# EAGLE design COM_ETH-V1 (EAGLE 4.16)

## Sheet 1 of 3
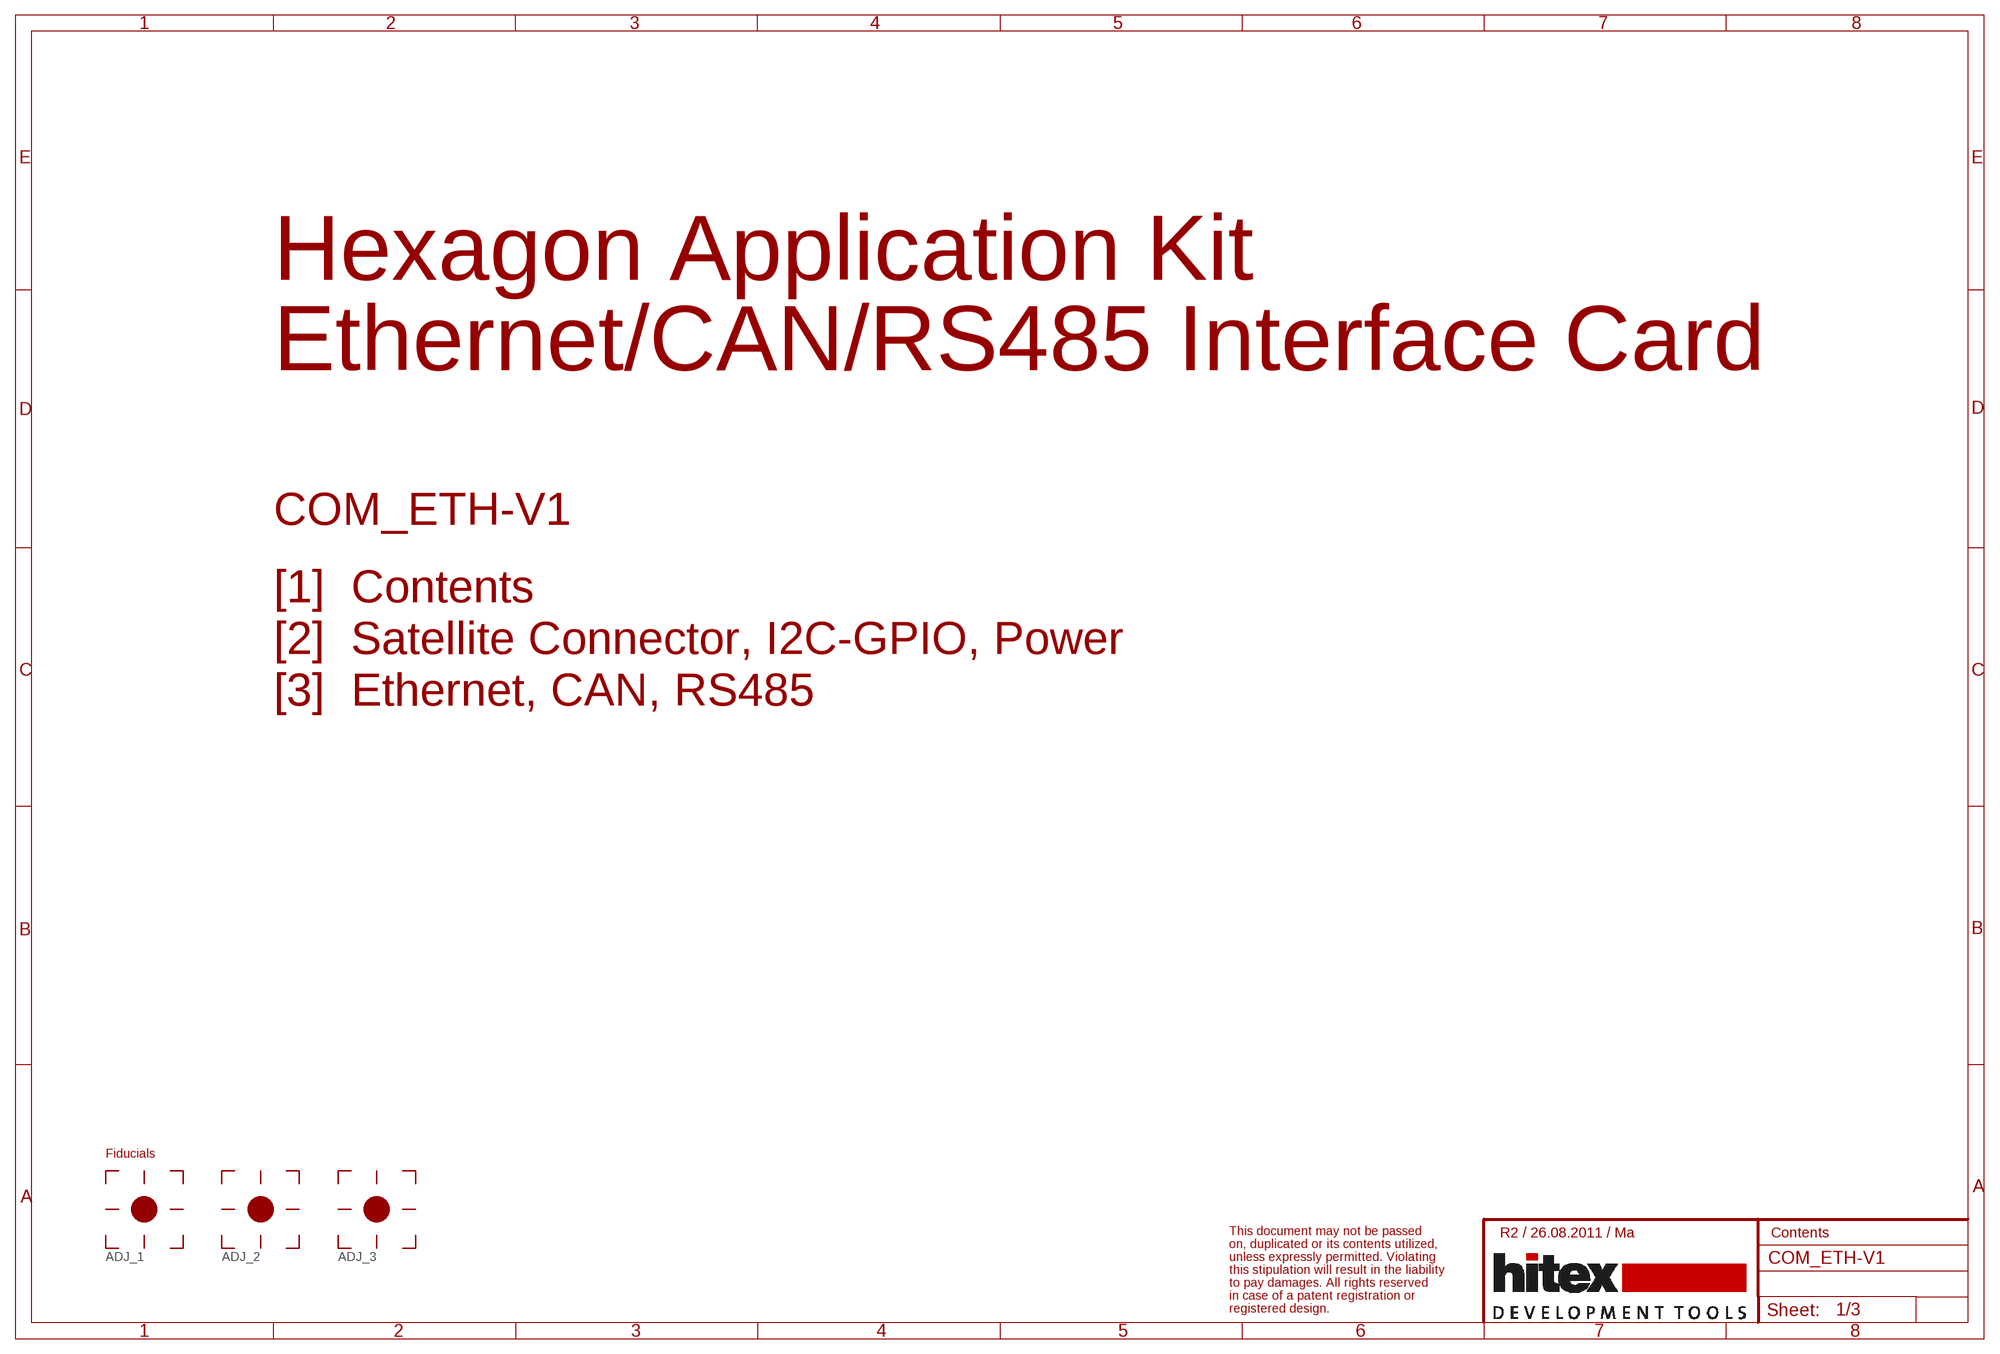
[diagram p0: schematic, sheet 1]

### Parts
ADJ_1  FIDUCIAL  [FIDUCIAL]
ADJ_2  FIDUCIAL  [FIDUCIAL]
ADJ_3  FIDUCIAL  [FIDUCIAL]

### Notes on the sheet
- Hexagon Application Kit
- Ethernet/CAN/RS485 Interface Card
- COM_ETH-V1
- [1]  Contents
- [2]  Satellite Connector, I2C-GPIO, Power
- [3]  Ethernet, CAN, RS485
- Fiducials
- R2 / 26.08.2011 / Ma | Contents

## Sheet 2 of 3
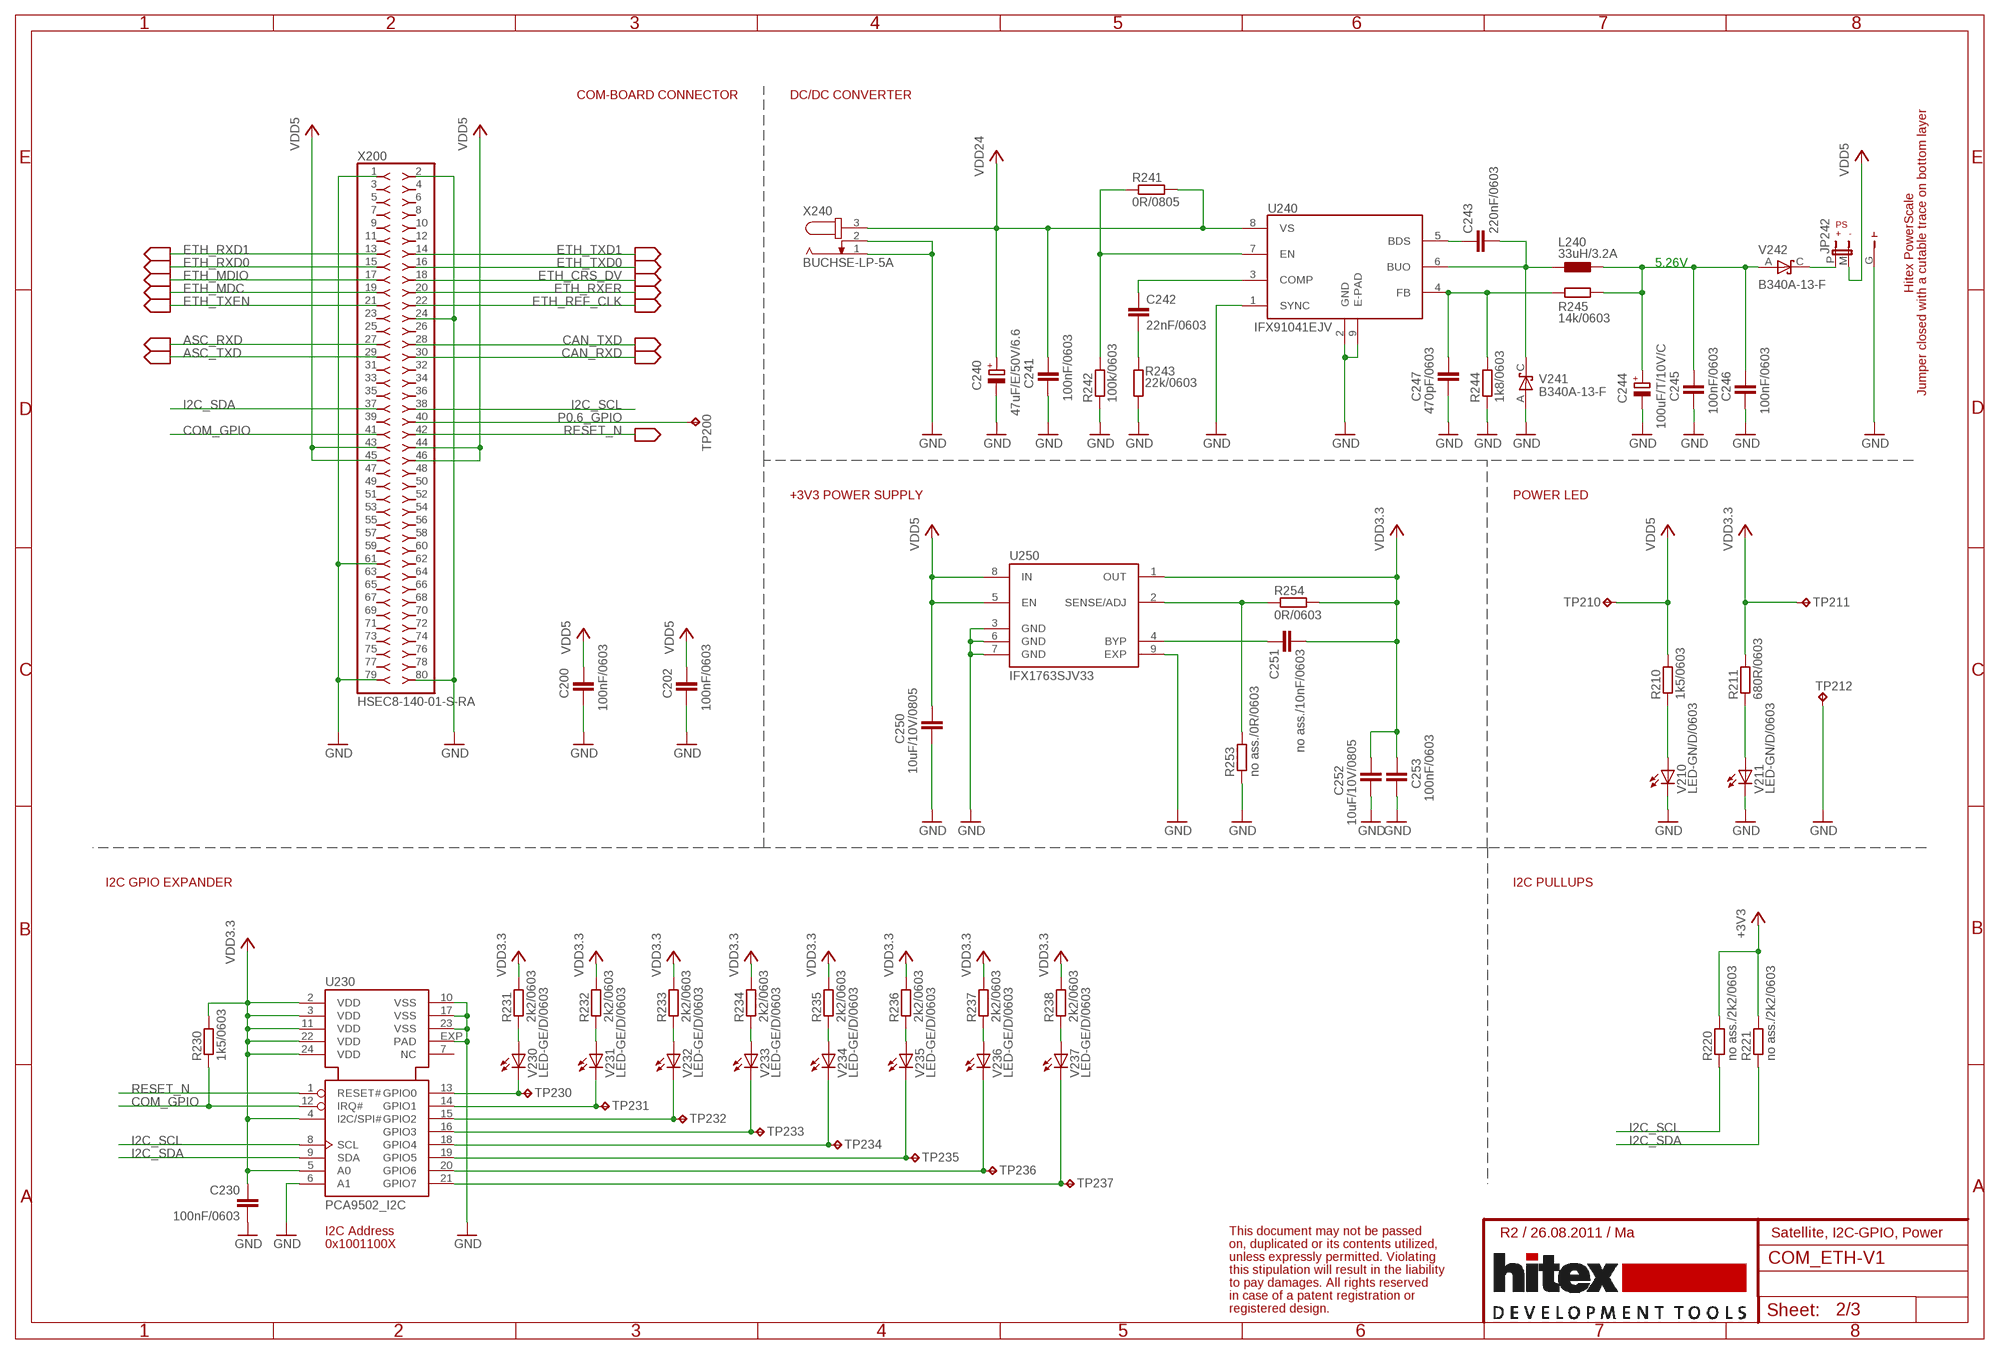
[diagram p1: schematic, sheet 2]

### Parts
C200  100nF/0603  C-EUC0603  [C0603]
C202  100nF/0603  C-EUC0603  [C0603]
C230  100nF/0603  C-EUC0603  [C0603]
C240  47uF/E/50V/6.6  CPOL-EUD  [PANASONIC_D]
C241  100nF/0603  C-EUC0603  [C0603]
C242  22nF/0603  C-EUC0603  [C0603]
C243  220nF/0603  C-EUC0603  [C0603]
C244  100uF/T/10V/C  CPOL-EUSMCC  [SMC_C]
C245  100nF/0603  C-EUC0603  [C0603]
C246  100nF/0603  C-EUC0603  [C0603]
C247  470pF/0603  C-EUC0603  [C0603]
C250  10uF/10V/0805  C-EUC0805K  [C0805K]
C251  no ass./10nF/0603  C-EUC0603  [C0603]
C252  10uF/10V/0805  C-EUC0805K  [C0805K]
C253  100nF/0603  C-EUC0603  [C0603]
JP242  POWERSCALE3  [PS3_PMG]
L240  33uH/3.2A  IHLP-3232DZ-11  [IHLP-3232DZ-11]
R210  1k5/0603  R-EU_R0603  [R0603]
R211  680R/0603  R-EU_R0603  [R0603]
R220  no ass./2k2/0603  R-EU_R0603  [R0603]
R221  no ass./2k2/0603  R-EU_R0603  [R0603]
R230  1k5/0603  R-EU_R0603  [R0603]
R231  2k2/0603  R-EU_R0603  [R0603]
R232  2k2/0603  R-EU_R0603  [R0603]
R233  2k2/0603  R-EU_R0603  [R0603]
R234  2k2/0603  R-EU_R0603  [R0603]
R235  2k2/0603  R-EU_R0603  [R0603]
R236  2k2/0603  R-EU_R0603  [R0603]
R237  2k2/0603  R-EU_R0603  [R0603]
R238  2k2/0603  R-EU_R0603  [R0603]
R241  0R/0805  R-EU_R0805  [R0805]
R242  100k/0603  R-EU_R0603  [R0603]
R243  22k/0603  R-EU_R0603  [R0603]
R244  1k8/0603  R-EU_R0603  [R0603]
R245  14k/0603  R-EU_R0603  [R0603]
R253  no ass./0R/0603  R-EU_R0603  [R0603]
R254  0R/0603  R-EU_R0603  [R0603]
TP200  TPAD1.5MM_RUND  [TPAD_1.5MM_RUND]
TP210  TPAD1.5MM_RUND  [TPAD_1.5MM_RUND]
TP211  TPAD1.5MM_RUND  [TPAD_1.5MM_RUND]
TP212  TPAD1.5MM_RUND  [TPAD_1.5MM_RUND]
TP230  TPAD1.5MM_RUND  [TPAD_1.5MM_RUND]
TP231  TPAD1.5MM_RUND  [TPAD_1.5MM_RUND]
TP232  TPAD1.5MM_RUND  [TPAD_1.5MM_RUND]
TP233  TPAD1.5MM_RUND  [TPAD_1.5MM_RUND]
TP234  TPAD1.5MM_RUND  [TPAD_1.5MM_RUND]
TP235  TPAD1.5MM_RUND  [TPAD_1.5MM_RUND]
TP236  TPAD1.5MM_RUND  [TPAD_1.5MM_RUND]
TP237  TPAD1.5MM_RUND  [TPAD_1.5MM_RUND]
U230  PCA9502_I2C  [HVQFN24]
U240  IFX91041EJV  [PSOP-8]
U250  IFX1763SJV33  IFX1763_PADNOP  [PG-DSO-8-27_NO-PASTE]
V210  LED-GN/D/0603  LEDCHIPLED_0603  [CHIPLED_0603]
V211  LED-GN/D/0603  LEDCHIPLED_0603  [CHIPLED_0603]
V230  LED-GE/D/0603  LEDCHIPLED_0603  [CHIPLED_0603]
V231  LED-GE/D/0603  LEDCHIPLED_0603  [CHIPLED_0603]
V232  LED-GE/D/0603  LEDCHIPLED_0603  [CHIPLED_0603]
V233  LED-GE/D/0603  LEDCHIPLED_0603  [CHIPLED_0603]
V234  LED-GE/D/0603  LEDCHIPLED_0603  [CHIPLED_0603]
V235  LED-GE/D/0603  LEDCHIPLED_0603  [CHIPLED_0603]
V236  LED-GE/D/0603  LEDCHIPLED_0603  [CHIPLED_0603]
V237  LED-GE/D/0603  LEDCHIPLED_0603  [CHIPLED_0603]
V241  B340A-13-F  [DO214AC]
V242  B340A-13-F  [DO214AC]
X200  HSEC8-140-01-S-RA  [HSEC8-140-XX-X-RA]
X240  BUCHSE-LP-5A  JACK-PLUG0  [SPC4077]

### Nets
ASC_RXD: X200.27 ; also sheet 3
ASC_TXD: X200.29 ; also sheet 3
CAN_RXD: X200.30 ; also sheet 3
CAN_TXD: X200.28 ; also sheet 3
COM_GPIO: R230.1 U230.12(IRQ#) X200.41
ETH_CRS_DV: X200.18 ; also sheet 3
ETH_MDC: X200.19 ; also sheet 3
ETH_MDIO: X200.17 ; also sheet 3
ETH_REF_CLK: X200.22 ; also sheet 3
ETH_RXD0: X200.15 ; also sheet 3
ETH_RXD1: X200.13 ; also sheet 3
ETH_RXER: X200.20 ; also sheet 3
ETH_TXD0: X200.16 ; also sheet 3
ETH_TXD1: X200.14 ; also sheet 3
ETH_TXEN: X200.21 ; also sheet 3
GND: C200.2 C202.2 C230.2 C240.- C241.2 C244.- C245.2 C246.2 C247.2 C250.2 C252.2 C253.2 JP242.G R242.1 R243.1 R244.1 R253.1 TP212.1(TP) U230.6(A1) U230.10(VSS) U230.17(VSS) U230.23(VSS) U230.EXP(PAD) U240.1(SYNC) U240.2(GND) U240.9(E-PAD) U250.3(GND) U250.6(GND) U250.7(GND) U250.9(EXP) V210.C V211.C V241.A X200.1 X200.2 X200.24 X200.61 X200.79 X200.80 X240.1 X240.2 ; also sheet 3
I2C_SCL: R220.1 U230.8(SCL) X200.38
I2C_SDA: R221.1 U230.9(SDA) X200.37
N$8: C243.2 L240.1 U240.6(BUO) V241.C
N$16: C244.+ C245.1 C246.1 L240.2 R245.2 V242.A
N$19: C243.1 U240.5(BDS)
N$21: C247.1 R244.2 R245.1 U240.4(FB)
N$22: R241.1 R242.2 U240.7(EN)
N$25: C242.1 U240.3(COMP)
N$26: C242.2 R243.2
N$27: JP242.P V242.C
N$29: R231.1 V230.A
N$30: R232.1 V231.A
N$38: R233.1 V232.A
N$40: R234.1 V233.A
N$42: R235.1 V234.A
N$43: R236.1 V235.A
N$44: R237.1 V236.A
N$45: R238.1 V237.A
N$47: C251.1 U250.4(BYP)
N$55: R210.1 V210.A
N$56: R211.1 V211.A
N$57: TP230.1(TP) U230.13(GPIO0) V230.C
N$58: TP231.1(TP) U230.14(GPIO1) V231.C
N$59: TP232.1(TP) U230.15(GPIO2) V232.C
N$60: TP233.1(TP) U230.16(GPIO3) V233.C
N$61: TP234.1(TP) U230.18(GPIO4) V234.C
N$62: TP235.1(TP) U230.19(GPIO5) V235.C
N$63: TP236.1(TP) U230.20(GPIO6) V236.C
N$64: TP237.1(TP) U230.21(GPIO7) V237.C
N$68: R253.2 R254.1 U250.2(SENSE/ADJ)
P0.6_GPIO: TP200.1(TP) X200.40
RESET_N: U230.1(RESET#) X200.42 ; also sheet 3
VDD3.3: C230.1 C251.2 C252.1 C253.1 R211.2 R220.2 R221.2 R230.2 R231.2 R232.2 R233.2 R234.2 R235.2 R236.2 R237.2 R238.2 R254.2 TP211.1(TP) U230.2(VDD) U230.3(VDD) U230.4(I2C/SPI#) U230.5(A0) U230.11(VDD) U230.22(VDD) U230.24(VDD) U250.1(OUT) ; supply symbol labelled +3V3 ; also sheet 3
VDD5: C200.1 C202.1 C250.1 JP242.M R210.2 TP210.1(TP) U250.5(EN) U250.8(IN) X200.43 X200.44 X200.45 X200.46 ; also sheet 3
VDD24: C240.+ C241.1 R241.2 U240.8(VS) X240.3
Unconnected: U230.7(NC) X200.3 X200.4 X200.5 X200.6 X200.7 X200.8 X200.9 X200.10 X200.11 X200.12 X200.23 X200.25 X200.26 X200.31 X200.32 X200.33 X200.34 X200.35 X200.36 X200.39 X200.47 X200.48 X200.49 X200.50 X200.51 X200.52 X200.53 X200.54 X200.55 X200.56 X200.57 X200.58 X200.59 X200.60 X200.62 X200.63 X200.64 X200.65 X200.66 X200.67 X200.68 X200.69 X200.70 X200.71 X200.72 X200.73 X200.74 X200.75 X200.76 X200.77 X200.78

### Notes on the sheet
- COM-BOARD CONNECTOR | DC/DC CONVERTER
- 5.26V
- Hitex PowerScale
- Jumper closed with a cutable trace on bottom layer
- +3V3 POWER SUPPLY | POWER LED
- I2C GPIO EXPANDER | I2C PULLUPS
- I2C Address | R2 / 26.08.2011 / Ma | Satellite, I2C-GPIO, Power
- 0x1001100X

## Sheet 3 of 3
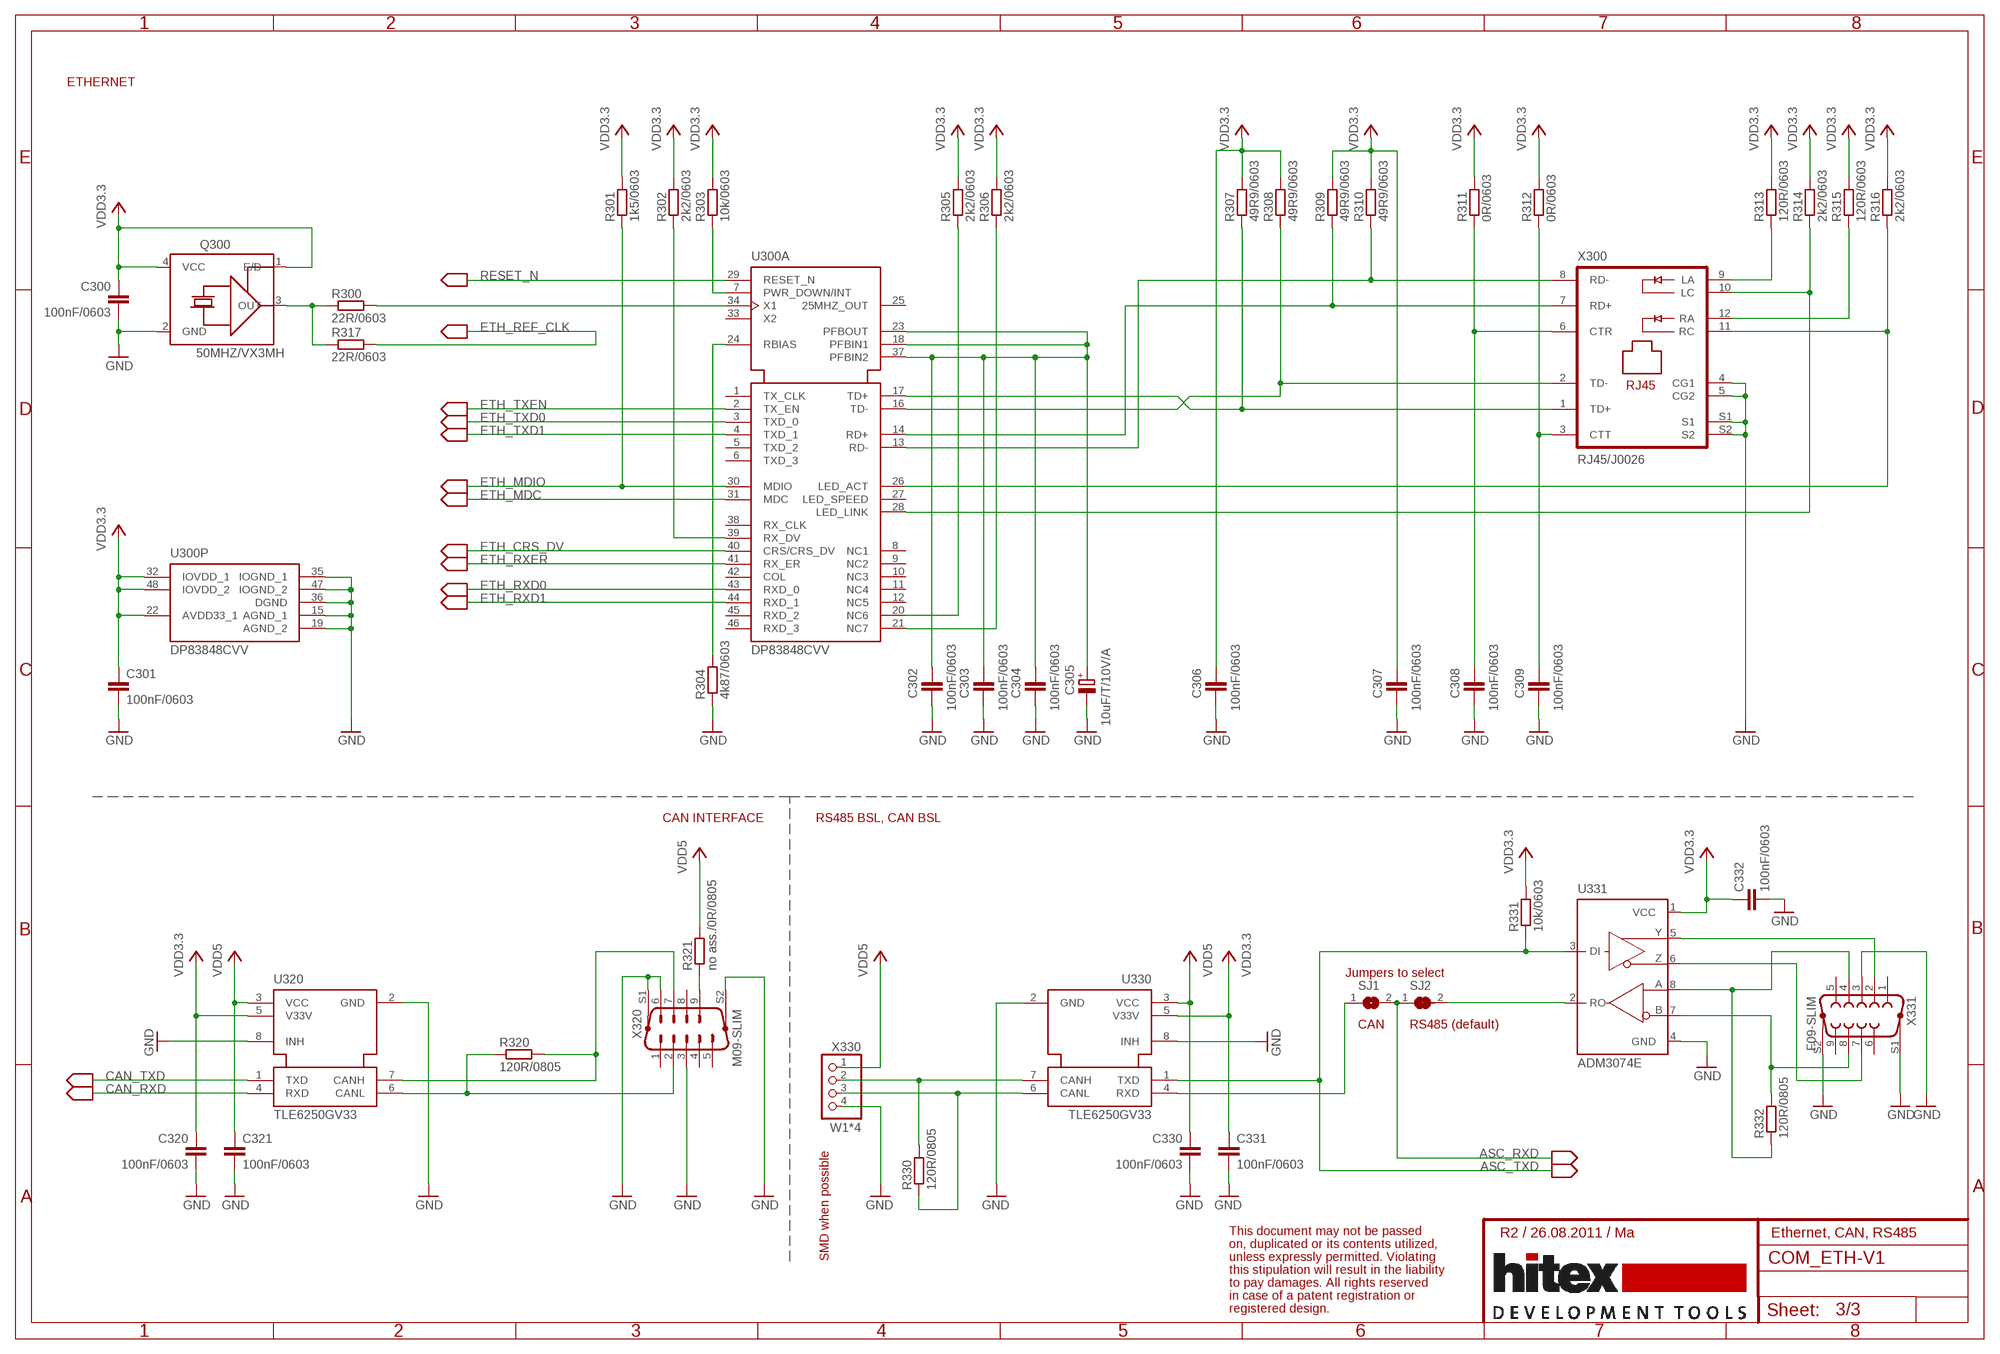
[diagram p2: schematic, sheet 3]

### Parts
C300  100nF/0603  C-EUC0603  [C0603]
C301  100nF/0603  C-EUC0603  [C0603]
C302  100nF/0603  C-EUC0603  [C0603]
C303  100nF/0603  C-EUC0603  [C0603]
C304  100nF/0603  C-EUC0603  [C0603]
C305  10uF/T/10V/A  CPOL-EUSMCA  [SMC_A]
C306  100nF/0603  C-EUC0603  [C0603]
C307  100nF/0603  C-EUC0603  [C0603]
C308  100nF/0603  C-EUC0603  [C0603]
C309  100nF/0603  C-EUC0603  [C0603]
C320  100nF/0603  C-EUC0603  [C0603]
C321  100nF/0603  C-EUC0603  [C0603]
C330  100nF/0603  C-EUC0603  [C0603]
C331  100nF/0603  C-EUC0603  [C0603]
C332  100nF/0603  C-EUC0603  [C0603]
Q300  50MHZ/VX3MH  OSC_VX3.37.0_X_5.0  [OSC7*5]
R300  22R/0603  R-EU_R0603  [R0603]
R301  1k5/0603  R-EU_R0603  [R0603]
R302  2k2/0603  R-EU_R0603  [R0603]
R303  10k/0603  R-EU_R0603  [R0603]
R304  4k87/0603  R-EU_R0603  [R0603]
R305  2k2/0603  R-EU_R0603  [R0603]
R306  2k2/0603  R-EU_R0603  [R0603]
R307  49R9/0603  R-EU_R0603  [R0603]
R308  49R9/0603  R-EU_R0603  [R0603]
R309  49R9/0603  R-EU_R0603  [R0603]
R310  49R9/0603  R-EU_R0603  [R0603]
R311  0R/0603  R-EU_R0603  [R0603]
R312  0R/0603  R-EU_R0603  [R0603]
R313  120R/0603  R-EU_R0603  [R0603]
R314  2k2/0603  R-EU_R0603  [R0603]
R315  120R/0603  R-EU_R0603  [R0603]
R316  2k2/0603  R-EU_R0603  [R0603]
R317  22R/0603  R-EU_R0603  [R0603]
R320  120R/0805  R-EU_R0805  [R0805]
R321  no ass./0R/0805  R-EU_R0805  [R0805]
R330  120R/0805  R-EU_R0805  [R0805]
R331  10k/0603  R-EU_R0603  [R0603]
R332  120R/0805  R-EU_R0805  [R0805]
SJ1  SJ0402PASTE  [R0402]
SJ2  SJ0402PASTE  [R0402]
U300  DP83848CVV  [LQFP48]
U320  TLE6250GV33  [SO08]
U330  TLE6250GV33  [SO08]
U331  ADM3074E  MAX3467CPA  [SO08]
X300  RJ45/J0026  J0026  [PJ-J0]
X320  M09-SLIM  [M09G-SLIM]
X330  W1*4  PINHD-1X4  [1X04]
X331  F09-SLIM  [F09G-SLIM]

### Nets
ASC_RXD: SJ1.2 SJ2.1 ; also sheet 2
ASC_TXD: R331.1 U330.1(TXD) U331.3(DI) ; also sheet 2
CAN_RXD: U320.4(RXD) ; also sheet 2
CAN_TXD: U320.1(TXD) ; also sheet 2
ETH_CRS_DV: U300.40(A:CRS/CRS_DV) ; also sheet 2
ETH_MDC: U300.31(A:MDC) ; also sheet 2
ETH_MDIO: R301.1 U300.30(A:MDIO) ; also sheet 2
ETH_REF_CLK: R317.2 ; also sheet 2
ETH_RXD0: U300.43(A:RXD_0) ; also sheet 2
ETH_RXD1: U300.44(A:RXD_1) ; also sheet 2
ETH_RXDV: R302.1 U300.39(A:RX_DV)
ETH_RXER: U300.41(A:RX_ER) ; also sheet 2
ETH_TXD0: U300.3(A:TXD_0) ; also sheet 2
ETH_TXD1: U300.4(A:TXD_1) ; also sheet 2
ETH_TXEN: U300.2(A:TX_EN) ; also sheet 2
GND: C300.2 C301.2 C302.2 C303.2 C304.2 C305.- C306.2 C307.2 C308.2 C309.2 C320.2 C321.2 C330.2 C331.2 C332.2 Q300.2(GND) R304.1 U300.15(P:AGND_1) U300.19(P:AGND_2) U300.35(P:IOGND_1) U300.36(P:DGND) U300.47(P:IOGND_2) U320.2(GND) U320.8(INH) U330.2(GND) U330.8(INH) U331.4(GND) X300.4(CG1) X300.5(CG2) X300.S1 X300.S2 X320.3 X320.6 X320.S1(G1) X320.S2(G2) X330.4 X331.3 X331.S1(G1) X331.S2(G2) ; also sheet 2
N$1: C302.1 C303.1 C304.1 C305.+ U300.18(A:PFBIN1) U300.23(A:PFBOUT) U300.37(A:PFBIN2)
N$2: R305.1 U300.20(A:NC6)
N$3: R306.1 U300.21(A:NC7)
N$5: R304.2 U300.24(A:RBIAS)
N$6: R310.1 U300.13(A:RD-) X300.8(RD-)
N$7: R303.1 U300.7(A:PWR_DOWN/INT)
N$9: R309.1 U300.14(A:RD+) X300.7(RD+)
N$10: R307.1 U300.17(A:TD+) X300.1(TD+)
N$11: R308.1 U300.16(A:TD-) X300.2(TD-)
N$12: R316.1 U300.26(A:LED_ACT) X300.11(RC)
N$13: R315.1 X300.12(RA)
N$14: R314.1 U300.28(A:LED_LINK) X300.10(LC)
N$15: R313.1 X300.9(LA)
N$17: C308.1 R311.1 X300.6(CTR)
N$18: C309.1 R312.1 X300.3(CTT)
N$24: Q300.3(OUT) R300.1 R317.1
N$28: R330.1 U330.6(CANL) X330.3
N$31: R332.2 U331.7(B) X331.8
N$33: R320.2 U320.7(CANH) X320.7
N$34: R332.1 U331.8(A) X331.4
N$35: U331.5(Y) X331.2
N$36: U331.6(Z) X331.7
N$37: R321.1 X320.9
N$46: R330.2 U330.7(CANH) X330.2
N$49: R320.1 U320.6(CANL) X320.2
N$50: SJ1.1 U330.4(RXD)
N$53: SJ2.2 U331.2(RO)
N$69: R300.2 U300.34(A:X1)
RESET_N: U300.29(A:RESET_N) ; also sheet 2
VDD3.3: C300.1 C301.1 C306.1 C307.1 C320.1 C331.1 C332.1 Q300.1(E/D) Q300.4(VCC) R301.2 R302.2 R303.2 R305.2 R306.2 R307.2 R308.2 R309.2 R310.2 R311.2 R312.2 R313.2 R314.2 R315.2 R316.2 R331.2 U300.22(P:AVDD33_1) U300.32(P:IOVDD_1) U300.48(P:IOVDD_2) U320.5(V33V) U330.5(V33V) U331.1(VCC) ; also sheet 2
VDD5: C321.1 C330.1 R321.2 U320.3(VCC) U330.3(VCC) X330.1 ; also sheet 2
Unconnected: U300.1(A:TX_CLK) U300.5(A:TXD_2) U300.6(A:TXD_3) U300.8(A:NC1) U300.9(A:NC2) U300.10(A:NC3) U300.11(A:NC4) U300.12(A:NC5) U300.25(A:25MHZ_OUT) U300.27(A:LED_SPEED) U300.33(A:X2) U300.38(A:RX_CLK) U300.42(A:COL) U300.45(A:RXD_2) U300.46(A:RXD_3) X320.1 X320.4 X320.5 X320.8 X331.1 X331.5 X331.6 X331.9

### Notes on the sheet
- ETHERNET
- CAN INTERFACE | RS485 BSL, CAN BSL
- Jumpers to select
- CAN | RS485 (default)
- R2 / 26.08.2011 / Ma | Ethernet, CAN, RS485
- SMD when possible

## Library data of the parts
ADJ_1-ADJ_3 = Global:FIDUCIAL: Fiducial FIDUCIAL: Durchmesser = 0.75mm Kupfer und 1.5mm Lötstopmaske FIDUCIAL 0.5mm: Durchmesser= 0.5mm Kupfer und 1.0mm Lötstopmaske
C200 C202 C230 C241-C243 C245-C247 C251 C253 C300-C304 C306-C309 C320 C321 C330-C332 = DsC:C-EUC0603
C240 C244 C305 = rcl:CPOL-EU: POLARIZED CAPACITOR, European symbol
C250 C252 = rcl:C-EU: CAPACITOR, European symbol
JP242 = XTV254:POWERSCALE3
L240 = PDCoil:IHLP-3232DZ-11
Q300 = PrjLPC24:OSC_VX3.3
R210 R211 R220 R221 R230-R238 R242-R245 R253 R254 R300-R317 R331 = DsR:R-EU_R0603
R241 R320 R321 R330 R332 = rcl:R-EU_: RESISTOR, European symbol
SJ1 SJ2 = Rs_RND:SJ0402
TP200 TP210-TP212 TP230-TP237 = Global:TPAD
U230 = ICMisc:PCA9502_I2C
U240 = IvregS:IFX91041EJV
U250 = IvregL:IFX1763_PAD: Infineon IFX1763 LDO with exposed pad Device: - IFX1763_PADNOP = device without solder paste on the exposed pad - IFX1763_PADWIP = device with solder paste on the exposed pad
U300 = IIOCOM:DP83848C
U320 U330 = IIOCOM:TLE6250GV33
U331 = maxim:MAX3467*: +5V, Fail-Safe, 40Mbps, Profibus RS-485/RS-422 Transceivers Source: MAX3465-MAX3469.pdf
V210 V211 V230-V237 = led:LED: LED OSRAM: - CHIPLED LG R971, LG N971, LY N971, LG Q971, LY Q971, LO R971, LY R971 LH N974, LH R974 LS Q976, LO Q976, LY Q976 LO Q996 - Hyper CHIPLED LW Q18S LB Q993, LB Q99A, LB R99A - SideLED LS A670, LO A670, LY A670, LG A670, LP A670 LB A673, LV A673, LT A673, LW A673 LH A674 LY A675 LS A676, LA A676, LO A676, LY A676, LW A676 LS A679, LY A679, LG A679 - Hyper Micro SIDELED® LS Y876, LA Y876, LO Y876, LY Y876 LT Y87S - SmartLED LW L88C, LW L88S LB L89C, LB L89S, LG L890 LS L89K, LO L89K, LY L89K LS L896, LA L896, LO L896, LY L896 - TOPLED LS T670, LO T670, LY T670, LG T670, LP T670 LSG T670, LSP T670, LSY T670, LOP T670, LYG T670 LG T671, LOG T671, LSG T671 LB T673, LV T673, LT T673, LW T673 LH T674 LS T676, LA T676, LO T676, LY T676, LB T676, LH T676, LSB T676, LW T676 LB T67C, LV T67C, LT T67C, LS T67K, LO T67K, LY T67K, LW E67C LS E67B, LA E67B, LO E67B, LY E67B, LB E67C, LV E67C, LT E67C LW T67C LS T679, LY T679, LG T679 LS T770, LO T770, LY T770, LG T770, LP T770 LB T773, LV T773, LT T773, LW T773 LH T774 LS E675, LA E675, LY E675, LS T675 LS T776, LA T776, LO T776, LY T776, LB T776 LHGB T686 LT T68C, LB T68C - Hyper Mini TOPLED® LB M676 - Mini TOPLED Santana® LG M470 LS M47K, LO M47K, LY M47K Source: http://www.osram.convergy.de - LUMILED® LXK2-PW12-R00, LXK2-PW12-S00, LXK2-PW14-U00, LXK2-PW14-V00 LXK2-PM12-R00, LXK2-PM12-S00, LXK2-PM14-U00 LXK2-PE12-Q00, LXK2-PE12-R00, LXK2-PE12-S00, LXK2-PE14-T00, LXK2-PE14-U00 LXK2-PB12-K00, LXK2-PB12-L00, LXK2-PB12-M00, LXK2-PB14-N00, LXK2-PB14-P00, LXK2-PB14-Q00 LXK2-PR12-L00, LXK2-PR12-M00, LXK2-PR14-Q00, LXK2-PR14-R00 LXK2-PD12-Q00, LXK2-PD12-R00, LXK2-PD12-S00 LXK2-PH12-R00, LXK2-PH12-S00 LXK2-PL12-P00, LXK2-PL12-Q00, LXK2-PL12-R00 Source: www.luxeon.com
V241 V242 = DsDiod:B340A-13-F
X200 = Xsr080:HSEC8-140-01-S-RA
X240 = con-jack:JACK-PLUG: DC POWER JACK Power Jack, DC, Right Angle, Through Hole, Rated 5A at 16VDC, PC Terminals Distributor: Farnell (www.Farnell.de) Drawing: 84N1161.pdf / 84N1162.pdf Manufacturer: SPC Technology (www.spctechnology.com) Type: SPC4077 / SPC 4078
X300 = XRnd:J0026: RJ45 PulseJack w/LEDs
X320 = D-Sub-SMT-Slim:M09-SLIM
X330 = pinhead:PINHD-1X4: PIN HEADER
X331 = D-Sub-SMT-Slim:F09-SLIM

## Board
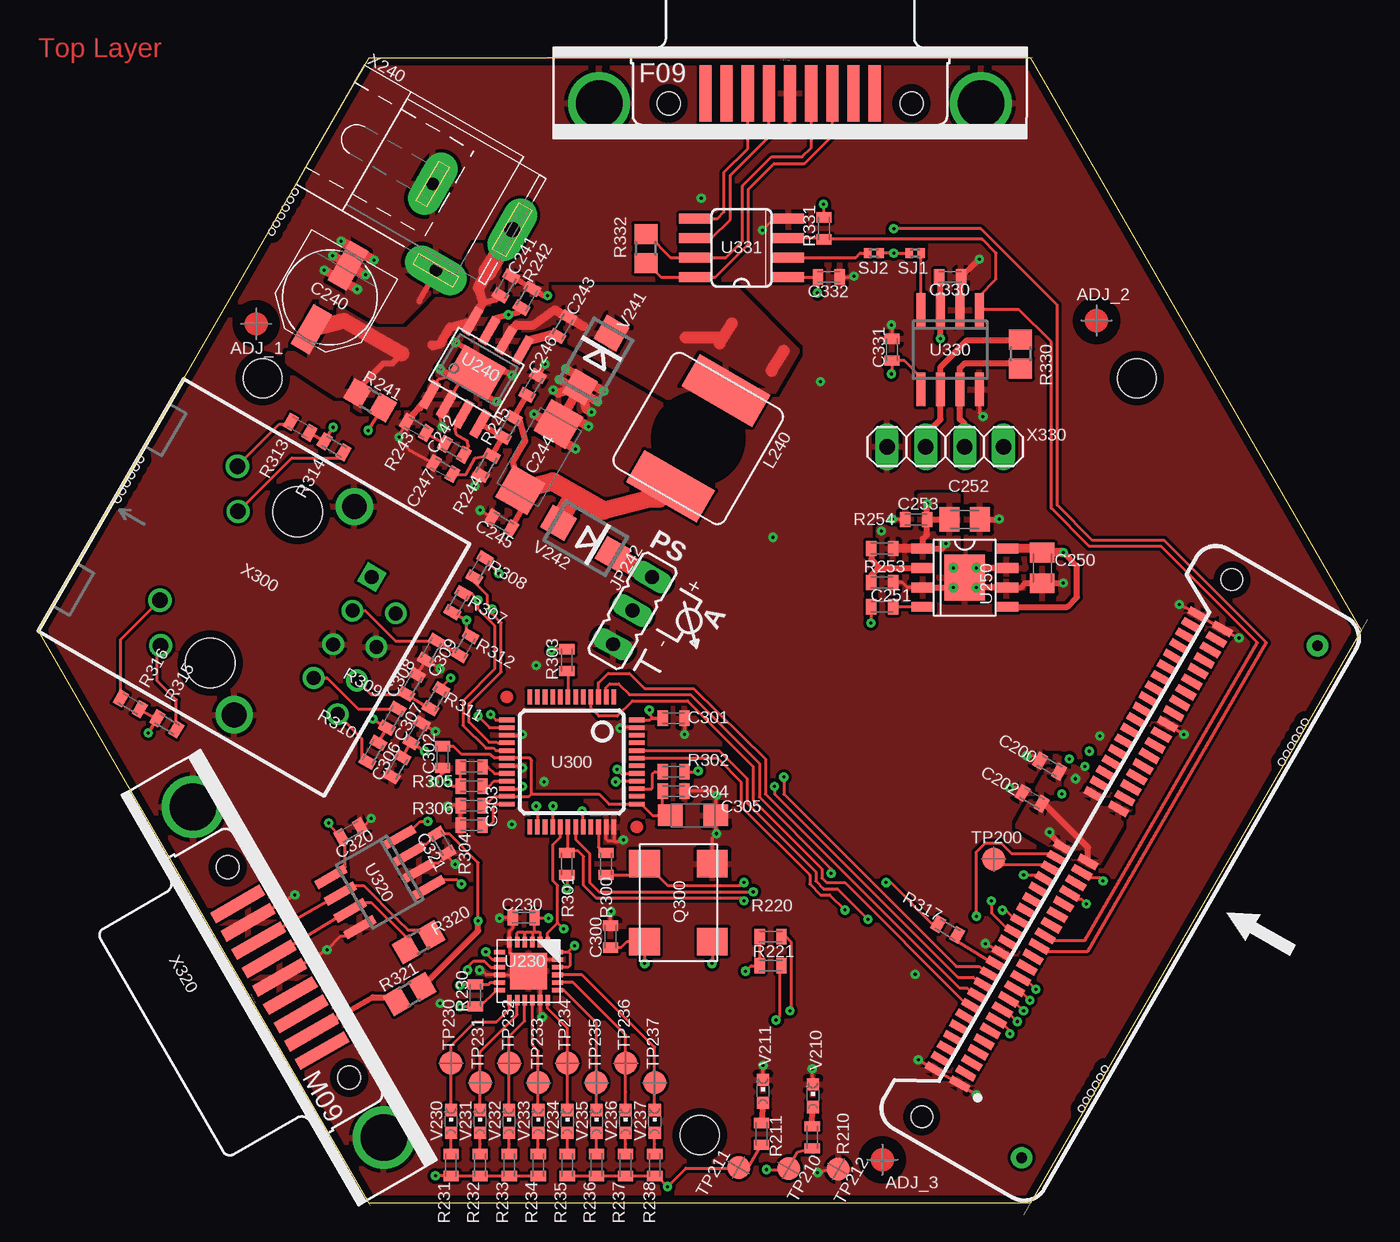
[diagram p3: board, top side]
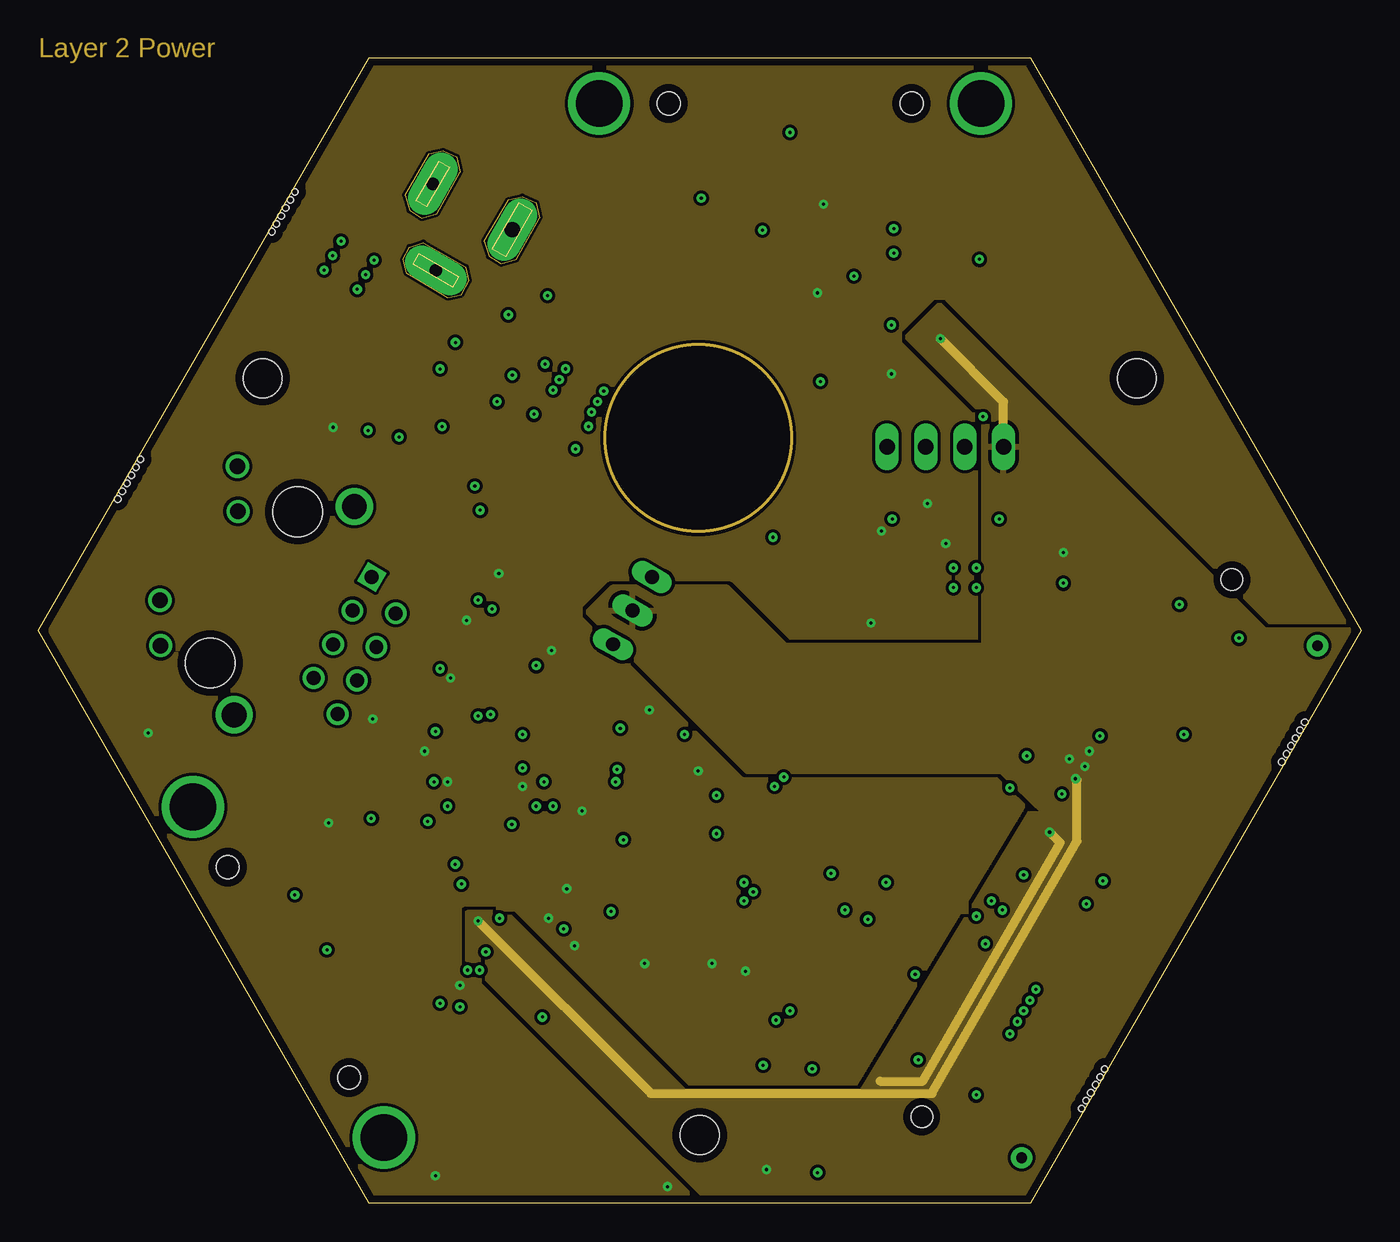
[diagram p4: board, inner layer Route2]
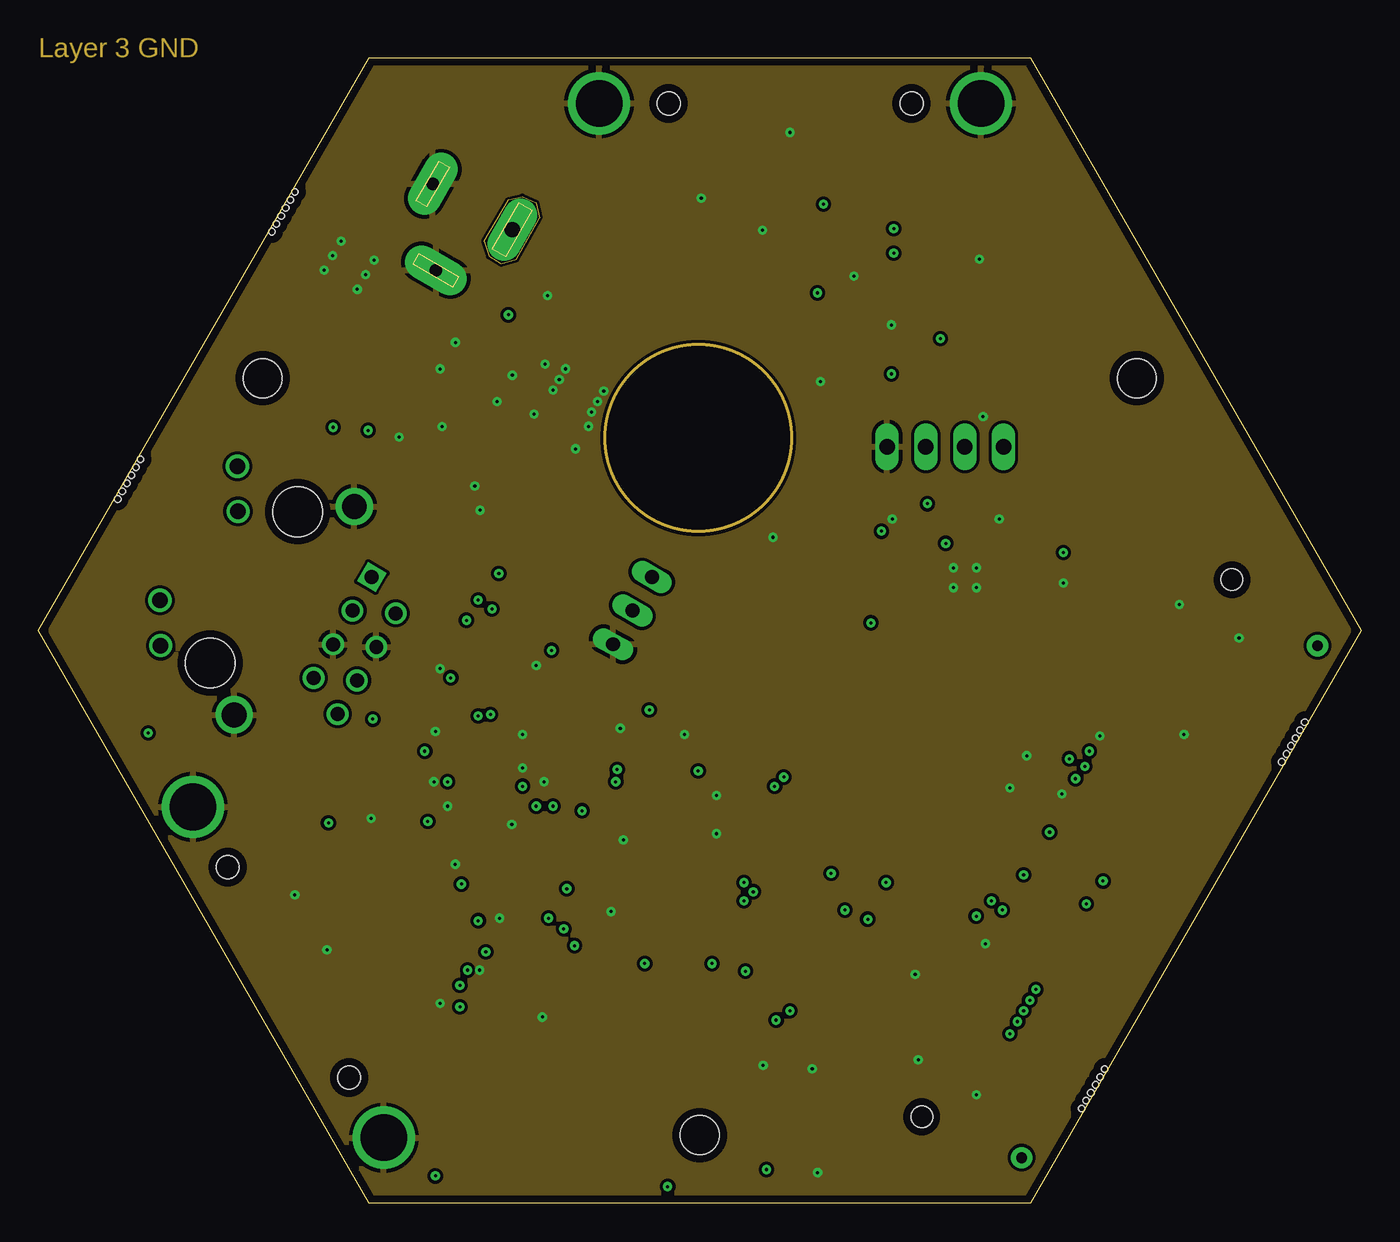
[diagram p5: board, inner layer Route15]
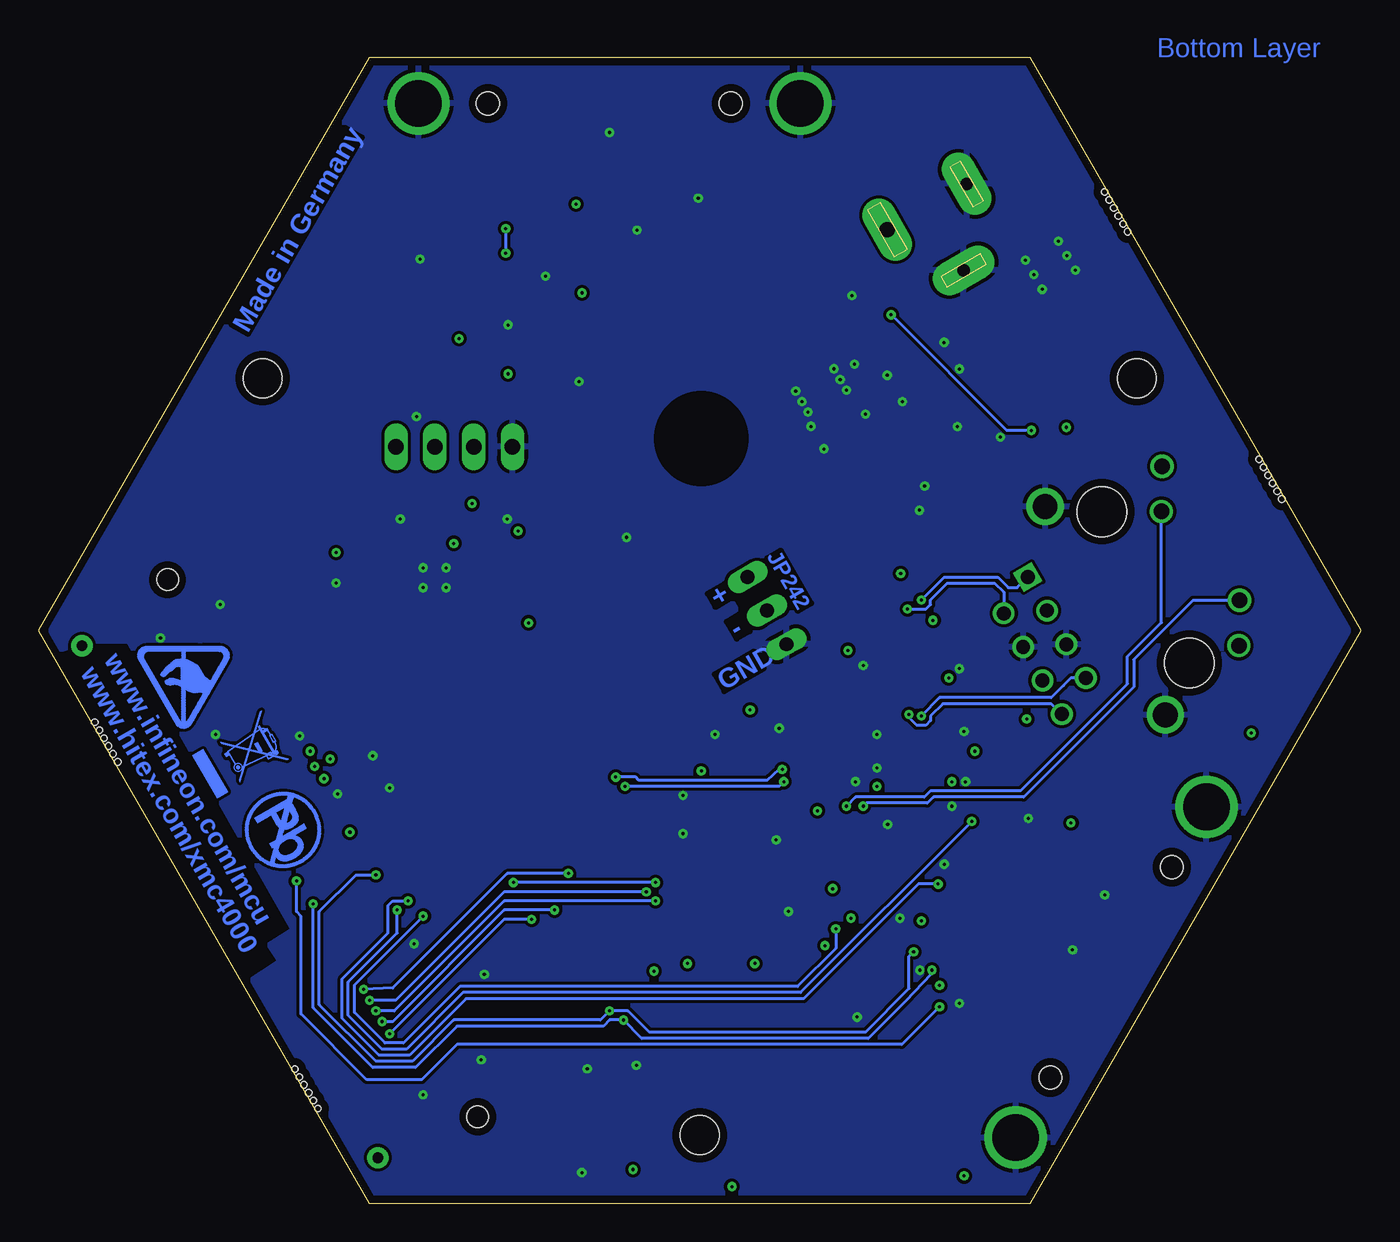
[diagram p6: board, bottom side, seen from below]

Size 86.6 x 75 mm. Coordinates in mm from the lower left corner, seen from the top.
Outline: 21.65,75 64.95,75 86.6,37.5 64.95,0 21.65,0 0,37.5 21.65,75
Copper layers (1*2+15*16): Top 0.035mm / dielectric 0.5mm / Route2 0.035mm / dielectric 0.5mm / Route15 0.035mm / dielectric 0.5mm / Bottom 0.035mm
Design rules "default": minimum track width 0.2mm, minimum drill 0.2mm, track to track 0.2mm, track to pad 0.2mm, pad to pad 0.2mm, via to via 0.2mm, smd to smd 0.2mm, copper to edge 0.5mm, drill to drill 0.5mm, minimum pad ring 10mil, minimum via ring 0.2mm, stop-mask expansion 4mil, vias tented up to drill 0.2mm, thermal gap 10mil
Holes 2.54 mm at 14.7,54.02 71.91,54.02 43.3,4.47
Holes 0.4 mm at 68.3,6.2 68.6,6.72 68.9,7.24 69.2,7.76 69.5,8.28 69.8,8.8 82.9,31.5 82.6,30.98 82.3,30.46 82,29.94 81.7,29.42 81.4,28.9 16.8,66.2 16.5,65.68 16.2,65.16 15.9,64.64 15.6,64.12 15.3,63.6 5.2,46.1 5.5,46.62 5.8,47.14 6.1,47.66 6.4,48.18 6.7,48.7
tRestrict: area 62.6,40.9 to 64.1,41
bRestrict: 8 lines

### Footprints (pad centres in the part's own frame; a part is rotated, then mirrored left to right if it is on the bottom)
C0603 = smd 0.67 x 1: 1 -0.715,0; 2 0.715,0
PANASONIC_D = smd 3 x 1.4: + 2.4,0; - -2.4,0
SMC_C = smd 2.4 x 2.4: + -2.5,0; - 2.5,0
C0805K = smd 1.3 x 1.6: 1 -1,0; 2 1,0
SMC_A = smd 1.6 x 1.4: + -1.5,0; - 1.5,0
PS3_PMG = drill 0.914 long: G 2.54,0; M 0,0; P -2.54,0
IHLP-3232DZ-11 = smd 2.413 x 5.334: 1 -3.619,0; 2 3.619,0
OSC7*5 = smd 1.8 x 2: 1 -2.54,-2.54; 2 2.54,-2.54; 3 2.54,1.905; 4 -2.54,1.905
R0603 = smd 0.67 x 1: 1 -0.715,0; 2 0.715,0
R0805 = smd 1.3 x 1.5: 1 -0.95,0; 2 0.95,0
R0402 = smd 0.5 x 0.65: 1 -0.4,0; 2 0.4,0
TPAD_1.5MM_RUND = smd 1.5 x 1.5: 1 0,0
HVQFN24 = smd 0.7 x 0.3: 1 -1.9,1.25; 2 -1.9,0.75; 3 -1.9,0.25; 4 -1.9,-0.25; 5 -1.9,-0.75; 6 -1.9,-1.25; 13 1.9,-1.25; 14 1.9,-0.75; 15 1.9,-0.25; 16 1.9,0.25; 17 1.9,0.75; 18 1.9,1.25 | smd 0.3 x 0.7: 7 -1.25,-1.9; 8 -0.75,-1.9; 9 -0.25,-1.9; 10 0.25,-1.9; 11 0.75,-1.9; 12 1.25,-1.9; 19 1.25,1.9; 20 0.75,1.9; 21 0.25,1.9; 22 -0.25,1.9; 23 -0.75,1.9; 24 -1.25,1.9 | smd 2.4 x 2.4: EXP 0,0
PSOP-8 = smd 0.61 x 1.905: 1 -1.905,-2.781; 2 -0.635,-2.781; 3 0.635,-2.781; 4 1.905,-2.781; 5 1.905,2.781; 6 0.635,2.781; 7 -0.635,2.781; 8 -1.905,2.781 | smd 3.099 x 2.413: 9 0,0
PG-DSO-8-27_NO-PASTE = smd 0.65 x 1.51: 1 -1.905,-2.745; 2 -0.635,-2.745; 3 0.635,-2.745; 4 1.905,-2.745; 5 1.905,2.745; 6 0.635,2.745; 7 -0.635,2.745; 8 -1.905,2.745 | smd 3 x 2.65: 9 0,0
LQFP48 = smd 0.3 x 1: 1 -2.75,-4.25; 2 -2.25,-4.25; 3 -1.75,-4.25; 4 -1.25,-4.25; 5 -0.75,-4.25; 6 -0.25,-4.25; 7 0.25,-4.25; 8 0.75,-4.25; 9 1.25,-4.25; 10 1.75,-4.25; 11 2.25,-4.25; 12 2.75,-4.25; 25 2.75,4.25; 26 2.25,4.25; 27 1.75,4.25; 28 1.25,4.25; 29 0.75,4.25; 30 0.25,4.25; 31 -0.25,4.25; 32 -0.75,4.25; 33 -1.25,4.25; 34 -1.75,4.25; 35 -2.25,4.25; 36 -2.75,4.25 | smd 1 x 0.3: 13 4.25,-2.75; 14 4.25,-2.25; 15 4.25,-1.75; 16 4.25,-1.25; 17 4.25,-0.75; 18 4.25,-0.25; 19 4.25,0.25; 20 4.25,0.75; 21 4.25,1.25; 22 4.25,1.75; 23 4.25,2.25; 24 4.25,2.75; 37 -4.25,2.75; 38 -4.25,2.25; 39 -4.25,1.75; 40 -4.25,1.25; 41 -4.25,0.75; 42 -4.25,0.25; 43 -4.25,-0.25; 44 -4.25,-0.75; 45 -4.25,-1.25; 46 -4.25,-1.75; 47 -4.25,-2.25; 48 -4.25,-2.75
SO08 = smd 0.6 x 2.2: 1 -1.905,-2.6; 2 -0.635,-2.6; 3 0.635,-2.6; 4 1.905,-2.6; 5 1.905,2.6; 6 0.635,2.6; 7 -0.635,2.6; 8 -1.905,2.6
SO08' = smd 0.66 x 2.032: 1 -1.905,-3.073; 2 -0.635,-3.073; 3 0.635,-3.073; 4 1.905,-3.073; 5 1.905,3.073; 6 0.635,3.073; 7 -0.635,3.073; 8 -1.905,3.073
CHIPLED_0603 = smd 0.8 x 0.8: A 0,-0.75; C 0,0.75
DO214AC = smd 1.8 x 1.7: A 2.05,0; C -2.05,0
HSEC8-140-XX-X-RA = smd 0.5 x 1.35: 1 -17.2,-0.925; 2 -17.2,0.925; 3 -16.4,-0.925; 4 -16.4,0.925; 5 -15.6,-0.925; 6 -15.6,0.925; 7 -14.8,-0.925; 8 -14.8,0.925; 9 -14,-0.925; 10 -14,0.925; 11 -13.2,-0.925; 12 -13.2,0.925; 13 -12.4,-0.925; 14 -12.4,0.925; 15 -11.6,-0.925; 16 -11.6,0.925; 17 -10.8,-0.925; 18 -10.8,0.925; 19 -10,-0.925; 20 -10,0.925; 21 -9.2,-0.925; 22 -9.2,0.925; 23 -8.4,-0.925; 24 -8.4,0.925; 25 -7.6,-0.925; 26 -7.6,0.925; 27 -6.8,-0.925; 28 -6.8,0.925; 29 -6,-0.925; 30 -6,0.925; 31 -5.2,-0.925; 32 -5.2,0.925; 33 -4.4,-0.925; 34 -4.4,0.925; 35 -3.6,-0.925; 36 -3.6,0.925; 37 -2.8,-0.925; 38 -2.8,0.925; 39 -2,-0.925; 40 -2,0.925; 41 -1.2,-0.925; 42 -1.2,0.925; 43 -0.4,-0.925; 44 -0.4,0.925; 45 3.6,-0.925; 46 3.6,0.925; 47 4.4,-0.925; 48 4.4,0.925; 49 5.2,-0.925; 50 5.2,0.925; 51 6,-0.925; 52 6,0.925; 53 6.8,-0.925; 54 6.8,0.925; 55 7.6,-0.925; 56 7.6,0.925; 57 8.4,-0.925; 58 8.4,0.925; 59 9.2,-0.925; 60 9.2,0.925; 61 10,-0.925; 62 10,0.925; 63 10.8,-0.925; 64 10.8,0.925; 65 11.6,-0.925; 66 11.6,0.925; 67 12.4,-0.925; 68 12.4,0.925; 69 13.2,-0.925; 70 13.2,0.925; 71 14,-0.925; 72 14,0.925; 73 14.8,-0.925; 74 14.8,0.925; 75 15.6,-0.925; 76 15.6,0.925; 77 16.4,-0.925; 78 16.4,0.925; 79 17.2,-0.925; 80 17.2,0.925 | drill 0.7 pad 1.4 round: S1 -19.35,-6.86; S2 19.35,-6.86 | hole 1.4: -20.3,0.15; 20.3,0.15
SPC4077 = drill 0.8 pad 2.184 long: 1 -3,0; 2 0,-4.8 | drill 1 pad 2.184 long: 3 3,0
PJ-J0 = drill 0.914 square: 1 4.445,-6.35 | drill 0.914 round: 2 3.175,-8.89; 3 1.905,-6.35; 4 0.635,-8.89; 5 -0.635,-6.35; 6 -1.905,-8.89; 7 -3.175,-6.35; 8 -4.445,-8.89 | drill 1.016 round: 9 6.325,4.902; 10 3.785,3.378; 11 -3.81,4.902; 12 -6.35,3.378 | drill 1.626 round: S1 -7.874,-3.048; S2 7.874,-3.048 | hole 3.251: -5.715,0; 5.715,0
M09G-SLIM = smd 0.8 x 3.7: 1 -5.54,-1.85; 2 -2.77,-1.85; 3 0,-1.85; 4 2.77,-1.85; 5 5.54,-1.85; 6 -4.155,-1.85; 7 -1.385,-1.85; 8 1.385,-1.85; 9 4.155,-1.85 | drill 3.05 round: S1 -12.495,-1.2; S2 12.495,-1.2 | hole 1.5: -7.95,-1.2; 7.95,-1.2
1X04 = drill 1.016 long: 1 -3.81,0; 2 -1.27,0; 3 1.27,0; 4 3.81,0
F09G-SLIM = smd 0.8 x 3.7: 1 5.54,-1.85; 2 2.77,-1.85; 3 0,-1.85; 4 -2.77,-1.85; 5 -5.54,-1.85; 6 4.155,-1.85; 7 1.385,-1.85; 8 -1.385,-1.85; 9 -4.155,-1.85 | drill 3.05 round: S1 -12.495,-1.2; S2 12.495,-1.2 | hole 1.5: -7.95,-1.2; 7.95,-1.2

### Placement (x,y rotation side)
ADJ_1  14.27,57.57 0 top
ADJ_2  69.27,57.78 0 top
ADJ_3  55.25,2.86 0 top
C200  66.2,28.62 150 top
C202  65.05,26.51 150 top
C230  31.78,18.7 180 top
C240  19.09,59.3 240 top
C241  30.61,60.05 60 top
C242  27.24,49.36 150 top
C243  34.34,57.39 60 top
C244  32.81,48.85 60 top
C245  30.33,44.54 150 top
C246  32.35,53.54 60 top
C247  26.5,48.1 150 top
C250  65.72,41.59 270 top
C251  55.25,39.05 180 top
C252  60.64,44.77 0 top
C253  57.47,44.77 180 top
C300  37.47,17.46 90 top
C301  41.59,31.75 0 top
C302  26.47,29.21 270 top
C303  28.38,26.04 180 top
C304  41.59,26.99 0 top
C305  42.86,25.4 0 top
C306  23.5,28.57 240 top
C307  24.77,30.8 60 top
C308  24.45,33.97 60 top
C309  25.72,36.2 240 top
C320  20.45,24.33 30 top
C321  26.43,23.57 300 top
C330  59.69,60.64 0 top
C331  55.88,55.88 90 top
C332  51.75,60.64 0 top
JP242  38.9,38.8 240 top
L240  43.2,50.07 240 top
Q300  41.59,19.68 90 top
R210  50.66,4.33 270 top
R211  47.34,4.54 270 top
R220  47.94,17.46 180 top
R221  47.94,15.56 180 top
R230  28.61,13.62 90 top
R231  27.02,2.51 270 top
R232  28.92,2.51 270 top
R233  30.83,2.51 270 top
R234  32.73,2.51 270 top
R235  34.64,2.51 270 top
R236  36.54,2.51 270 top
R237  38.45,2.51 270 top
R238  40.35,2.51 270 top
R241  21.73,52.56 150 top
R242  31.99,59.25 240 top
R243  24.76,50.79 330 top
R244  29.34,48.32 60 top
R245  30.77,50.79 60 top
R253  55.25,40.64 180 top
R254  55.25,42.86 0 top
R300  37.17,22.23 90 top
R301  34.61,22.23 270 top
R302  41.59,28.26 0 top
R303  34.61,35.56 90 top
R304  28.38,24.77 0 top
R305  28.38,28.57 180 top
R306  28.38,27.3 180 top
R307  27.46,39.33 240 top
R308  28.89,41.59 60 top
R309  23.18,31.75 240 top
R310  21.91,29.53 60 top
R311  26.04,33.02 60 top
R312  27.94,36.51 60 top
R313  17.15,50.8 330 top
R314  19.37,49.53 150 top
R315  8.41,31.39 150 top
R316  6.03,32.7 330 top
R317  59.53,17.93 330 top
R320  24.9,17.1 210 top
R321  24.3,13.7 30 top
R330  64.3,55.6 270 top
R331  51.44,63.82 90 top
R332  39.78,62.5 90 top
SJ1  57.4,62.2 180 top
SJ2  54.7,62.2 180 top
TP200  62.55,22.54 0 top
TP210  49.11,2.29 240 top
TP211  45.84,2.34 240 top
TP212  52.38,2.24 240 top
TP230  27.02,9.18 270 top
TP231  28.92,7.91 270 top
TP232  30.83,9.18 270 top
TP233  32.73,7.91 270 top
TP234  34.64,9.18 270 top
TP235  36.54,7.91 270 top
TP236  38.45,9.18 270 top
TP237  40.35,7.91 270 top
U230  32.1,15.21 270 top
U240  28.68,54.4 330 top
U250  60.64,40.96 270 top
U300  34.93,28.89 180 top
U320  22.35,21.03 120 top
U330  59.69,55.88 180 top
U331  ADM3074E  [SO08']  46.04,62.55 90 top
U$71  [DIN_A5_L]  -50.8,-38.1 0 top  (outside the outline)
V210  50.71,7.05 0 top
V211  47.44,7.34 0 top
V230  27.02,5.37 0 top
V231  28.92,5.37 0 top
V232  30.83,5.37 0 top
V233  32.73,5.37 0 top
V234  34.64,5.37 0 top
V235  36.54,5.37 0 top
V236  38.45,5.37 0 top
V237  40.35,5.37 0 top
V241  36.5,55.2 240 top
V242  35.84,43.52 150 top
X200  68.11,23.18 60 top
X240  28.43,65.23 330 top
X300  14.12,40.32 60 top
X320  17.42,15.73 300 top
X330  59.37,49.53 180 top
X331  49.21,70.8 180 top

### Tracks (layer width: path | path; a pad name or v marks a point on that pad's centre or on a via)
ASC_RXD  (via drill 0.2)
  Top 0.2: X200.27 65.84,16.5 68.7,16.5 80.4,36.7 73.7,43.4 69,43.4 66.7,45.7 66.7,58.8 61.7,63.8 v56,63.8 | SJ1.2 v56,62.2 SJ2.1
  Bottom 0.2: v56,63.8 v56,62.2
ASC_TXD
  Top 0.2: X200.29 66.23,17.2 68.5,17.2 79.8,36.7 73.5,43 68.8,43 66.3,45.5 66.3,56.4 64.2,58.5 61.6,58.5 | U331.3 51.32,63.18 51.4,63.1 R331.1 61.8,63.1 62.7,62.2 62.7,60.5 61.6,59.4 61.6,58.5 | 61.6,58.5 U330.1 61.6,58.5
CAN_RXD  (via drill 0.2)
  Top 0.2: U320.4 24.17,24.5 24.5,24.5 25,25 v25.5,25 | v63.1,19.2 63.3,19.2 64.06,18.44 X200.30
  Bottom 0.2: v63.1,19.2 63.1,17.7 66.3,14.5 66.3,12.3 64.1,10.1 62.5,10.1 58.8,13.8 36.7,13.8 v25.5,25
CAN_TXD  (via drill 0.2)
  Top 0.2: U320.1 25.88,20.68 26.4,21.2 27.4,21.2 v27.7,20.9 | X200.28 63.65,17.75 62.4,19 v62.4,19.8
  Bottom 0.2: v62.4,19.8 63.4,19.8 63.7,19.5 63.7,17.7 66.7,14.7 66.7,12.1 64.3,9.7 62.3,9.7 58.6,13.4 36.5,13.4 29,20.9 v27.7,20.9
COM_GPIO  (via drill 0.2)
  Top 0.2: v27.6,12.87 27.64,12.91 R230.1 28.94,12.91 29.99,13.96 U230.12 | X200.41 68.53,21.67 68.9,21.3 69.5,21.3 v69.7,21.1
  Bottom 0.2: v27.6,12.87 30.07,10.4 59.2,10.4 61.5,8.1 65.1,8.1 69.4,12.4 69.4,18.8 69.7,19.1 v69.7,21.1
ETH_CRS_DV  (via drill 0.2)
  Top 0.2: X200.18 61.6,14.6 61.4,14.6 61.2,14.8 60.2,14.8 48.2,26.8 v48.2,27.3 | U300.40 37.84,27.64 v37.8,27.6
  Bottom 0.2: v37.8,27.6 38.1,27.3 v48.2,27.3
ETH_MDC  (via drill 0.2)
  Top 0.2: U300.31 35.18,23.82 36.1,22.9 36.1,21 36.7,20.4 v46.8,20.4 | X200.19 64.15,14.05 v64.9,13.3
  Bottom 0.2: v64.9,13.3 63.2,13.3 56.1,20.4 v46.8,20.4
ETH_MDIO  (via drill 0.2)
  Top 0.2: R301.1 34.61,22.99 34.6,23 34.68,23.07 | 34.68,23.07 U300.30 | 34.68,23.07 35.33,23.07 35.7,22.7 35.7,20.8 36.5,20 46,20 v46.2,19.8 | X200.17 63.74,13.36 v64.5,12.6
  Bottom 0.2: v64.5,12.6 63.3,12.6 56.1,19.8 v46.2,19.8
ETH_REF_CLK
  Top 0.2: X200.22 62.38,16 62.2,15.9 59.9,17.3 60.1,17.6 R317.2
ETH_RXD0  (via drill 0.2)
  Top 0.2: U300.43 44.46,29.14 46,27.6 46,26 50.5,21.5 50.5,20.9 51.2,20.2 51.8,20.2 v52.8,19.2 | X200.15 63.33,12.67 v64.1,11.9
  Bottom 0.2: v64.1,11.9 63.4,11.9 56.1,19.2 v52.8,19.2
ETH_RXD1  (via drill 0.2)
  Top 0.2: U300.44 44.56,29.64 46.4,27.8 46.4,26.2 50.9,21.7 50.9,21.1 51.4,20.6 52.3,20.6 v54.3,18.6 | X200.13 62.99,11.7 63.2,11.7 63.6,11.3 v63.6,11.1
  Bottom 0.2: v63.6,11.1 56.1,18.6 v54.3,18.6
ETH_RXDV
  Top 0.2: U300.39 40.14,27.14 40.2,27.2 40.2,28.1 40.36,28.26 R302.1
ETH_RXER  (via drill 0.2)
  Top 0.2: X200.20 62.12,14.98 61.6,15.5 60.1,15.5 48.8,26.8 v48.8,27.9 | U300.41 38.16,28.14 v37.9,28.4
  Bottom 0.2: v37.9,28.4 38.1,28.4 38.9,27.7 47.3,27.7 47.5,27.9 v48.8,27.9
ETH_TXD0
  Top 0.2: U300.3 36.68,34.08 37.3,34.7 38.7,34.7 39.7,33.7 42.9,33.7 47.6,29.1 47.6,26.8 60.3,14.1 60.8,14.1 61,13.9 61.2,13.9 X200.16
ETH_TXD1
  Top 0.2: X200.14 60.81,13.2 60.6,13.2 52.8,21 51.6,21 51.3,21.3 51.3,21.9 46.8,26.4 46.8,28.6 42.5,32.9 38.9,32.9 37.9,31.9 36.7,31.9 36.18,32.42 U300.4
ETH_TXEN  (via drill 0.2)
  Top 0.2: U300.2 37.18,33.77 37.4,34 38,34 38.7,33.3 42.7,33.3 47.2,28.8 47.2,26.6 51.9,21.9 v51.9,21.6 | X200.21 64.56,14.74 v65.3,14
  Bottom 0.2: v65.3,14 63.4,14.1 55.9,21.6 v51.9,21.6
GND  (via drill 0.2)
  Top 0.2: v33,12.2 32.85,12.35 U230.17 32.85,14.42 32.1,15.17 | v30.2,18.67 30.23,18.7 C230.2 31.07,18.04 30.85,17.82 U230.6 30.85,16.72 30.9,16.67 30.9,16.37 32.1,15.17 | v28.9,15.27 29.03,15.27 29.34,14.96 U230.10 31.89,14.96 32.1,15.17 | 32.1,15.17 U230.EXP 32.1,15.27 32.79,15.96 U230.23 | X320.3 v18.9,16.6 19.8,17.5 20.1,17.5 20.68,18.08 U320.8 | C320.2 21.29,24.69 v21.8,25.2 | U320.2 25.28,21.78 25.8,22.3 26.2,22.3 26.8,22.9 26.79,22.91 C321.2 26.79,22.71 v27.3,22.2 | X320.6 v16.8,20.2 | v26.8,26 26.84,26.04 C303.2 R304.1 | U300.19 31.56,28.64 v31.7,28.5 | C302.2 26.47,28.17 v25.9,27.6 | v26.3,35 C309.2 25.4,35.6 C308.2 | U300.15 31.64,30.64 v31.7,30.7 | C307.2 v26,30.9 | U300.35 37.18,23.82 37.3,23.7 37.7,23.7 | 37.7,23.7 38.2,23.7 v38.3,23.8 | U300.36 37.68,23.73 37.7,23.7 | C304.2 44.11,26.99 v44.4,26.7 44.36,26.66 C305.- 44.36,24.24 v44.4,24.2 44.13,23.93 Q300.2 | U300.47 38.14,31.14 v38.1,31.1 | C300.2 37.47,19.07 v37.5,19.1 | v61.4,7.1 60.8,7.5 60.48,7.82 X200.1 58.8,8.7 X200.2 v57.6,9.4 | X200.24 v62,17 | C301.2 v42.3,30.7 | X200.61 v75,30.7 | v78.6,37 X200.79 X200.80 v74.7,39.2 | C202.2 64.09,27.2 v63.6,27.2 | C200.2 65.25,29.3 v64.7,29.3 | R243.1 24.52,51.8 25.06,51.95 U240.1 26.21,53.94 28.45,54.54 28.46,54.52 U240.9 | R243.1 23.61,50.22 v23.62,50.17 | v26.44,50.85 26.27,51.49 U240.2 27.8,54.15 28.7,54.39 | U240.9 30.06,54.77 | U240.9 29.04,53.05 | U240.9 28.31,55.78 | U240.9 27.33,54.04 | 28.7,54.39 28.71,54.39 | U240.9 28.7,54.39 | R244.1 28.57,46.99 v28.58,46.96 | C245.2 28.94,45.34 v28.93,45.37 | X331.3 49.21,70.11 v49.2,70.1 | U331.4 48.15,64.45 v47.4,63.7 | C332.2 53.34,60.64 v53.4,60.7
  Top 0.2: 60.41,60.66 60.45,60.7 | 60.41,60.66 C330.2 | 60.33,60.58 60.41,60.66 | 61.36,61.56 v61.6,61.8 | C331.2 55.88,57.47 v55.85,57.5 | U330.8 61.6,51.75 v61.85,51.5 | V210.C v50.66,8.8 | V211.C v47.45,9.04 | TP212.1 52.21,2.33 v51.02,2.02 | C253.2 55.93,44.77 v55.9,44.8 | v61.41,41.59 v61.4,41.6 | 61.32,40.32 v61.4,40.3 | v67.09,40.59 v67.1,40.6 | R253.1 56.56,40.64 56.9,40.3 57.36,40.3 57.38,40.32 | 59.72,40.32 v59.9,40.3 | C247.2 24.3,49.3 23.6,50 23.6,50.2 23.7,50.2 | R243.1 24.2,51.2
  Top 0.4: 30.06,54.77 v31.03,54.21 | 29.04,53.05 v30.03,52.47 | 28.31,55.78 v27.31,56.36 | 27.33,54.04 v26.31,54.62 | C246.2 33.15,54.92 v33.18,54.93 | C241.2 R242.1 33.16,59.4 v33.33,59.42 | X240.2 26.05,60.98 24.94,59.05 | U330.2 60.33,60.58 | C330.2 61.36,61.56 | C252.2 62.87,44.77 v62.9,44.8 | U250.7 v61.41,41.59 | 61.32,40.32 U250.6 64.32,40.32 64.59,40.59 C250.2 v67.09,40.59 | 57.38,40.32 59.72,40.32 | 24.2,51.2 25.5,52.8
  Top 0.6: v32.45,51.66 33.75,50.91 34.02,50.98 | 34.02,50.98 34.04,50.98 C244.- | v35.18,49.39 34.31,49.89 34.02,50.98 | C244.- 34.07,51.05 34.07,51.07 35.16,51.36 v36.03,50.86 | V241.A 34.3,51.4 34.28,51.41 C244.- | v33.71,53.24 34.05,53.04 35.42,53.41 | V241.A 35.49,53.41 35.87,51.99 v36.22,51.79 | v34.11,53.93 35.15,53.33 35.42,53.41 | 35.42,53.41 V241.A | v36.62,52.48 35.49,53.13 35.42,53.41 | v34.51,54.62 35.29,54.17 35.47,53.49 | 35.47,53.49 35.48,53.44 V241.A | v37.02,53.17 36.15,53.67 35.47,53.49 | 20.86,62.39 v19.82,62.99 | C240.- 20.26,61.35 | 20.86,62.39 v21.99,61.74 | 20.31,61.44 20.86,62.39 | C240.- 20.31,61.44 | C240.- 20.37,61.33 | 20.31,61.44 v19.27,62.04 | 20.37,61.33 20.4,61.39 v21.44,60.79 | 19.85,60.43 v18.72,61.08 | 19.85,60.43 v20.89,59.83 | 19.85,60.43 20.37,61.33
  other vias: 43.4,65.8 51.2,53.8 48.1,43.6 31,24.8 32.6,35.2 33.1,27.6 26.3,13.1 57.4,15 69.5,30.6 67,26.8 59.9,41.6
  pour Route15: 64.9,0.2 86.4,37.5 64.8,74.8 21.8,74.8 0.2,37.5 21.8,0.2
  pour Bottom: 64.9,0.2 86.4,37.5 64.8,74.8 21.8,74.8 0.2,37.5 21.8,0.2
  pour Top (rank 3): 64.9,0.2 86.4,37.5 64.8,74.8 21.8,74.8 0.2,37.5 21.8,0.2
I2C_SCL  (via drill 0.2)
  Top 0.2: U230.8 29.71,15.96 29.3,16.37 v29.3,16.47 | R220.1 48.94,17.46 49.3,17.1 49.3,12.7 v49.2,12.6 v49.19,12.61 | X200.38 65.62,21.5 v64.5,21.5
  Bottom 0.2: v29.3,16.47 29.6,16.17 29.6,14.07 32.47,11.2 46.6,11.2 48,12.6 v49.2,12.6 49.8,12 59.4,12 62.1,9.3 64.5,9.3 68.2,13 68.2,19.1 65.8,21.5 v64.5,21.5
I2C_SDA  (via drill 0.2)
  Top 0.2: U230.9 29.61,15.46 29.2,15.87 28.5,15.87 28.1,15.47 v28.1,15.27 | R221.1 48.66,15.36 48.54,15.24 48.54,12.24 v48.3,12 | X200.37 67.71,20.29 68.1,19.9 68.3,19.9 v68.6,19.6
  Bottom 0.2: v28.1,15.27 28.1,15.07 29.8,13.27 32.27,10.8 47.1,10.8 v48.3,12 49.2,12 49.6,11.6 59.2,11.6 61.9,8.9 64.7,8.9 68.6,12.8 v68.6,19.6
N$1
  Top 0.2: C303.1 29.24,26.04 29.84,26.64 U300.23 32.14,26.64 32.3,26.8 | 32.3,26.8 32.3,29 32.16,29.14 U300.18 29.86,29.14 29.6,29.4 27.7,29.4 27.18,29.93 C302.1 | C304.1 40.88,25.84 41.32,25.4 C305.+ 40.2,25.4 39.46,26.14 U300.37 37.36,26.14 36.7,26.8 32.3,26.8
N$2
  Top 0.2: U300.20 29.86,28.14 29.43,28.57 R305.1
N$3
  Top 0.2: U300.21 29.84,27.64 29.51,27.3 R306.1
N$5
  Top 0.2: U300.24 29.94,26.14 29.8,26 29.8,25 29.57,24.77 R304.2
N$6  (via drill 0.2)
  Top 0.2: X300.8 21.19,30.41 21.19,29.01 21.29,28.91 | R310.1 21.29,28.91 | 21.29,28.91 21.3,28.9 | U300.13 29.96,31.64 v29.6,32
  Bottom 0.2: v29.6,32 29.6,31.8 29.1,31.3 28.5,31.3 28.2,31.6 28.2,31.9 27.4,32.7 20.3,32.7 19.63,32.03 X300.8
N$7
  Top 0.2: 34.61,34.89 34.6,34.9 | R303.1 34.61,34.89 | U300.7 34.68,34.83 34.61,34.89
N$8
  Top 0.6: U240.6 31.1,57.3 31.3,57.5 32.4,57.5 33.8,58.5 35.7,57.4 C243.2
  Top 0.8: 42.4,56.7 44.5,56.7 | 44.6,56.3 45.4,57.6 | 48,54.5 48.8,55.8
  pour Top (rank 2): 47.1,51.3 49.7,55.8 45.6,59.9 33.1,59.9 30.1,56.9 30.1,55.7 31.7,55.7 32.6,56.6 34.4,56.6 43.8,51.3
N$9  (via drill 0.2)
  Top 0.2: X300.7 18.9,34.4 20.93,32.37 R309.1 | U300.14 29.54,31.14 v28.8,31.9
  Bottom 0.2: v28.8,31.9 27.6,33.1 20.3,33.1 19.5,33.9 19,34.4 X300.7
N$10  (via drill 0.2)
  Top 0.2: U300.17 29.96,29.64 29.8,29.8 29.3,29.8 27.8,31.3 27.8,32.9 29.9,35 29.9,37.8 28.8,38.9 v28.8,39.5 28.4,39.9 27.8,39.9 27.8,39.92 R307.1
  Bottom 0.2: X300.1 22.54,40.3 23.1,40.3 23.8,41 27.3,41 v28.8,39.5
N$11  (via drill 0.2)
  Top 0.2: U300.16 30.06,30.14 30,30.2 29.5,30.2 28.2,31.5 28.2,32.7 30.3,34.8 30.3,38 29.7,38.6 v29.7,38.9 29.4,39.2 29.4,39.8 28.5,40.7 28.5,40.94 R308.1
  Bottom 0.2: X300.2 23.4,40 24,40.6 27.1,40.6 28.2,39.5 28.2,39.2 28.5,38.9 v29.7,38.9
N$12  (via drill 0.2)
  Top 0.2: R316.1 5.4,33.07 5.4,36.91 X300.11 | U300.26 32.68,25.93 v32.6,26
  Bottom 0.2: v32.6,26 32.4,26.2 28.4,26.2 28,26.6 22.1,26.6 14.9,33.8 14.9,35.6 11.03,39.47 X300.11
N$13
  Top 0.2: X300.12 7.8,36.3 7.8,34.2 9.03,32.97 R315.1
N$14  (via drill 0.2)
  Top 0.2: X300.10 16.6,48.8 19.8,48.8 19.8,48.99 R314.1 19.99,49.19 20,49.2 | U300.28 33.68,25.98 v33.7,26
  Bottom 0.2: v33.7,26 33.1,26.6 28.6,26.6 28.2,27 22.3,27 15.3,34 15.3,35.8 13.08,38.02 X300.10
N$15
  Top 0.2: R313.1 16.4,51.03 16.4,51 15.78,51 X300.9
N$16
  Top 0.2: 34.05,44.63 V242.A | C244.+ 31.54,46.66 31.52,46.65 31.79,45.64
  Top 0.4: C245.1 31.79,45.64 | R245.2 31.13,51.38 | R245.2 C246.1 | R245.2 31.56,51.16 31.89,49.9 31.09,48.51 31.57,46.72 C244.+
  Top 1.2: 35.09,46.44 37,45.34 40.04,46.15 40.65,46.15 41.4,46.9 41.39,46.9 L240.2 | C244.+ 33.67,47.26 35.09,46.44 | 35.09,46.44 34.05,44.63
N$17
  Top 0.2: X300.6 21.79,33.3 24.04,33.3 C308.1 25.6,32.4 R311.1
N$18
  Top 0.2: X300.3 21.4,38.8 23.39,36.81 C309.1 26.1,36.8 R312.1
N$19
  Top 0.4: U240.5 32.07,56.46 | 33.53,56.85 C243.1
  Top 0.6: 32.07,56.46 33.53,56.85
N$21
  Top 0.2: R244.2 29.7,49 28.6,48.8 28,47.7 27.1,47.7 C247.1
  Top 0.4: U240.4 28.96,51.02 28.96,51.01 R245.1 30.42,50.16 | 30.42,50.16 30.43,50.17 | R244.2 30.4,50.16 30.42,50.16
N$22  (via drill 0.2)
  Top 0.2: v21.6,50.6 R241.1
  Top 0.4: U240.7 30,57.96 v30.78,58.16 31.46,58.35 R242.2
  Bottom 0.2: 30.8,58.2 v30.78,58.16 30.76,58.16 23.2,50.6 v21.6,50.6
N$24  (via drill 0.2)
  Top 0.2: R300.1 39.41,21.51 39.7,21.8 39.69,21.8 Q300.3 39.78,22.23 41.2,20.8 46,20.8 v46.2,21 | R317.1 | v55.5,21 55.8,21 58.5,18.3 R317.1
  Bottom 0.2: v46.2,21 v55.5,21
N$25
  Top 0.2: U240.3 27.28,50.71 27.39,50.3 28.09,49.9 28.18,49.56 C242.1
N$26
  Top 0.2: R243.2 26.08,50.03 | 26.08,50.03 C242.2 | 26.08,50.03
N$27
  Top 0.6: V242.C 37.68,42.52 37.71,42.38
  Top 1.2: JP242.P 40.2,41 37.71,42.38
N$28
  Top 0.4: X330.3 58.1,50.35 59.06,51.31 U330.6 59.06,54.76 60.8,56.5 64.3,56.5 R330.1
N$29
  Top 0.2: R231.1 27.02,3.8 | 27.02,3.8 V230.A | 27.02,3.8
N$30
  Top 0.2: R232.1 28.92,3.9 V231.A
N$31
  Top 0.2: X331.8 50.6,69.2 50.6,69.1 50,68.5 48,68.5 46.1,66.6 46.1,63 45.01,61.91 U331.7 41.39,61.91 39.9,63.4 39.9,63.45 R332.2
N$33
  Top 0.2: X320.7 20.4,19.2 U320.7 20.94,19.7 21.8,19.7 24.1,17.4 24.1,16.6 R320.2
N$34
  Top 0.2: X331.4 51.98,69.88 50.17,68.06 48.17,68.06 46.5,66.4 46.5,62.8 44.34,60.64 U331.8 40.76,60.64 39.8,61.6 39.78,61.6 R332.1
N$35
  Top 0.2: X331.2 46.44,69.04 44.9,67.5 44.9,64.9 44.45,64.45 U331.5
N$36
  Top 0.2: X331.7 47.83,69.83 45.3,67.3 45.3,64.4 44.08,63.18 U331.6
N$37
  Top 0.4: X320.9 21.9,13.5 23.5,13.5 23.5,13.22 R321.1
N$38
  Top 0.2: R233.1 30.83,3.9 | 30.83,3.9 | 30.83,3.9 V232.A
N$40
  Top 0.2: 32.73,3.9 V233.A | R234.1 32.73,3.9 | 32.73,3.9
N$42
  Top 0.2: 34.64,3.9 V234.A | R235.1 34.64,3.9 | 34.64,3.9
N$43
  Top 0.2: 36.54,3.9 V235.A | 36.54,3.9 | R236.1 36.54,3.9
N$44
  Top 0.2: V236.A 38.45,3.9 R237.1
N$45
  Top 0.2: 40.35,3.9 V237.A | R238.1 40.35,3.9 | 40.35,3.9
N$46
  Top 0.4: X330.2 60.64,51.01 60.33,51.32 U330.7 60.33,54.68 60.65,55 63.9,55 64.3,54.6 R330.2
N$47
  Top 0.2: U250.4 57.9,39 57.85,39.05 C251.1
N$49
  Top 0.2: X320.2 19.8,20.3 U320.6 20.31,20.8 21.3,20.8 23.5,18.6 24.2,17.9 25.4,17.9 R320.1
N$50
  Top 0.2: U330.4 57.79,62.19 SJ1.1
N$53
  Top 0.2: SJ2.2 53.8,62.2 53.51,61.91 U331.2
N$55
  Top 0.2: 50.69,6.25 V210.A
  Top 0.4: R210.1 50.69,6.25
N$56
  Top 0.2: R211.1 47.41,5.37
  Top 0.4: 47.41,5.37 V211.A
N$57
  Top 0.2: V230.C TP230.1 27.02,10.32 28.6,11.9 30,11.9 30.85,12.75 U230.13
N$58
  Top 0.2: V231.C TP231.1 28.92,9.92 31.35,12.35 U230.14
N$59
  Top 0.2: V232.C TP232.1 30.83,10.93 31.85,11.95 U230.15
N$60
  Top 0.2: V233.C TP233.1 32.73,9.97 32.35,10.35 U230.16
N$61
  Top 0.2: V234.C TP234.1 34.64,11.46 33.35,12.75 U230.18
N$62
  Top 0.2: U230.19 34.41,13.96 36.54,11.83 TP235.1 36.54,6.9 | V235.C 36.54,6.9 | 36.54,6.9
N$63
  Top 0.2: 38.45,7.3 TP236.1 38.45,11.02 35.01,14.46 U230.20 | 38.45,7.3 | V236.C 38.45,7.3
N$64
  Top 0.2: V237.C TP237.1 40.35,10.22 35.61,14.96 U230.21
N$68
  Top 0.4: R253.2 54.53,41.13 54.99,41.59 55.11,41.59 | R254.1 54.53,42.17 55.11,41.59 | 55.11,41.59 U250.2
N$69
  Top 0.2: R300.2 37.1,22.94 37.1,22.9 36.68,23.32 U300.34
N$70
  Route15 0: 29.2,63 29.5,62 30.3,61.5 31.3,61.8 32.8,64.5 32.6,65.5 31.7,65.9 30.8,65.7 29.2,63
N$71
  Route2 0: 29.2,63 29.5,62 30.3,61.5 31.3,61.8 32.8,64.5 32.6,65.5 31.7,65.9 30.8,65.7 29.2,63
N$74
  Route2 0: 24,66 24.3,65 25.1,64.5 26.1,64.8 27.6,67.5 27.4,68.5 26.5,68.9 25.6,68.7 24,66
N$75
  Route2 0: 24.1,60.9 23.9,61.8 24.3,62.6 25.2,62.9 28,61.3 28.2,60.4 27.7,59.5 26.8,59.3 24.1,60.9
P0.6_GPIO
  Top 0.2: X200.40 66.1,21.91 65.8,22.2 62.9,22.2 TP200.1
RESET_N  (via drill 0.2)
  Top 0.2: U230.1 33.35,17.72 34,18.37 | 34,18.37 34,20.8 33.7,21.1 33.7,23.5 34.18,23.98 U300.29 | 34,18.37 v34.4,17.97 | v61.4,18.8 61.4,23 62,23.6 63,23.6 63.7,22.9 66.2,22.9 66.5,22.6 X200.42
  Bottom 0.2: v61.4,18.8 65.9,14.3 65.9,12.5 63.9,10.5 62.7,10.5 59,14.2 36.9,14.2 34.4,16.7 v34.4,17.97 34.4,18
VDD3.3  (via drill 0.2)
  Top 0.2: v26,1.8 v26.01,1.79 R231.2 R232.2 R233.2 R234.2 | R235.2 R236.2 R237.2 R238.2 40.49,1.79 v41.2,1.1 42.4,2.3 45.8,2.3 TP211.1 45.88,2.32 46.59,2.51 R211.2 | U230.11 29.59,14.46 29.47,14.34 R230.2 27.67,14.34 v27.6,14.27 | U230.5 31.35,17.72 31.4,17.77 31.8,17.77 31.85,17.72 U230.4 31.85,17.72 31.9,17.77 32.3,17.77 32.35,17.72 | 32.35,17.72 U230.3 | 32.35,17.72 32.4,17.77 32.5,17.77 | 32.5,17.77 32.8,17.77 32.85,17.72 U230.2 | 32.5,17.77 C230.1 33.37,18.7 v33.4,18.67 | U230.22 34.69,15.46 34.8,15.57 34.8,16.37 34.71,16.46 U230.24 34.69,16.46 v35.1,16.87 | U320.5 19.48,21.38 20.1,22 20.1,23.6 19.8,23.9 19.83,23.93 C320.1 19,24.8 v19,24.9 | v26.8,27.6 27.11,27.3 R306.2 R305.2 | U300.22 31.54,27.14 v31.7,27.3 | R301.2 v34.61,20.61 v34.6,20.6 | C306.1 24.4,30.2 C307.1 v25.3,29.6 | R310.2 22.8,31.1 R309.2 v21.9,31.7 | v30.15,41.23 29.3,42.08 29.3,42.2 R308.2 29.25,42.23 | R307.2 v28.03,38.17 28,38.14 28,37.43 R312.2 | v19.3,50.8 R314.2 18.7,49.9 R313.2 | R316.2 7.8,31.7 R315.2 v7.2,30.8 | R311.2 26.39,33.79 v27,34.4 | U300.32 35.68,25.62 v35.6,25.7 | U300.48 40.04,31.64 40.15,31.75 C301.1 40.25,31.75 40,32 v40,32.3 | R302.2 43.14,28.26 v43.2,28.3 | C300.1 38.15,16.75 38.55,17.14 Q300.4 39.69,15.71 v39.7,15.7 | Q300.1 44.13,15.73 v44.1,15.7 | R303.2 33.68,36.27 v33.6,36.2 | R220.2 R221.2 46.66,15.56 v46.3,15.2 | R331.2 51.44,65.36 v51.4,65.4 | U331.1 C332.1 51.04,59.64 v51,59.6 | U330.5 57.79,54.06 56.68,55.16 C331.1 55.88,54.33 v55.85,54.3 | 58.18,45.78 v58.2,45.8 | C251.2 54.53,38.03 v54.5,38
  Top 0.4: C253.1 58.18,43.78 57.9,43.5 U250.1 59.14,42.86 v59.4,43.2 | C253.1 C252.1 | C253.1 58.18,45.78
  Top 0.6: U250.1 R254.2
  other vias: 55.2,44
  pour Route2 (rank 3): 64.9,0.2 86.4,37.5 64.8,74.8 21.8,74.8 0.2,37.5 21.8,0.2
  pour Top (rank 2): 55,42.2 60.2,42.2 60.2,46.3 57.7,46.3 57.7,44.2 55,44.2
VDD5  (via drill 0.2)
  Top 0.2: U320.3 24.58,22.88 25.2,23.5 25.4,23.5 C321.1 | C321.1 26.1,24.2 | C321.1 26.91,24.19 28.8,22.3 v28.8,18.5 | C330.1 58.98,60.63 58.95,60.6 59.06,60.49 | R210.2 49.72,3.36 49.71,3.35 49.11,2.31 TP210.1 49.02,2.21 v47.66,2.21 | 65.85,26.15 C202.1
  Top 0.4: 59.06,60.49 U330.3 v59.06,56.59 v59.05,56.6 | X200.43 68.71,23.29 65.85,26.15 | X200.44 66.2,24.2 v66.2,24.3 | R321.2 28.8,17.85 v28.8,18.5 | U250.5 67.35,39.05 68,39.7 68,41.7 v67.1,42.6
  Top 0.6: v67.1,42.6 C250.1 65.71,42.59 65.44,42.86 U250.8
  Route2 0.6: v67.9,27.8 68,27.7 68,23.7 58.5,7.2 40.1,7.2 v28.8,18.5 | X330.1 63.18,52.47 v59.05,56.6 | 55.1,8 57.9,8 66.9,23.6 v66.2,24.3
  other vias: 67.5,29.1 68.5,28.6 68.8,29.6
  pour Top: 71.7,26.3 69.1,21.8 64.1,24.7 66.6,29.3
  pour Route2 (rank 2): 28.1,19 28.1,16 43.9,0.2 64.9,0.2 86.4,37.5 80.3,37.5 59,58.8 56.9,56.7 61.9,51.7 61.9,36.5 48.9,36.5 45.1,40.3 37.6,40.3 36,38.7 46.4,28.3 63,28.3 67.8,23.7 58.3,7.3 42.3,7.3 30.6,19
  pour Route2 (rank 2): 64.9,25.5 70.5,25.5 59.1,6.9 53.7,6.9
VDD24
  Top 0.4: 30.17,59.48 C241.1 30.23,59.42 30.17,59.46 30.02,59.2 29.11,58.96 29.1,58.95
  Top 0.406: R241.2 20.91,53.31 22.6,55 23.2,55 23.8,55.6 | 23.8,55.6 | 23.8,55.6 23.8,55.61
  Top 0.6: 28.84,59.94 29.1,58.95 U240.8 26.97,57.37 26.34,56.28 25.83,56.15 25.82,56.18 25.77,56.2
  Top 0.8: 28.84,59.94 X240.3
  Top 1: C240.+ 20.02,57.79 23.8,55.61
  Top 1.2: 29.4,61 31.1,63.8
  pour Top (rank 2): 16.3,55.2 18.6,59.1 22,57.1 24.2,57.1 27.4,60.3 28.8,62.7 30.4,61.8 30.4,60.2 28.8,57.4 27.1,57.4 24.1,52.4 21.2,52.4 21.2,52 18.1,54
(copper drawn outside any net)
  Bottom 0.1: 71.41,22.25 70.2,26.75 | 69.93,26.68 70.06,26.72 70.15,26.67 71.32,22.3
  shapes: Bottom area x4412, Route15 circle x1, Route2 circle x1

### Text on the board
Top: Top Layer
Route2: Layer 2 Power
Route15: Layer 3 GND
Bottom: Bottom Layer | Made in Germany | + | JP242 | - | www.infineon.com/mcu | www.hitex.com/xmc4000 | GND
tValues: 8x
bStop: + | JP242 | - | GND
Document: V1 / 15.12.2011 / Ma | 1/1
Reference: Mechanikplan | 75.00 | 37.50 | 4.47 | 43.30 | 21.65 | 43.30 | 21.65 | 86.60 | Alle Angaben in [mm] +/-0.1 | MPL
tBPL: Bestückungsplan | K | K | K | K | K | K | K | K | K | K | Alle C's ohne Wertangabe = 100N/0603 | TPx = Testpunkte n.m. | BPL
tSilk: Silkscreen | 24V | COM_ETH-V1- | X331 | RS485 | U331 | RS485 | CAN | X240 | U240 | + | U330 | X330 | 1 | X300 | GND | L | H | VDD5 | + | PS | + | JP242 | - | U250 | A | GND | COM | + | U320 | U300 | U230 | X320 | Q300 | GPIO | #0 | #1 | #2 | #3 | #4 | #5 | #6 | #7 | CAN | VDD3.3 | VDD5 | GND
Drill_legend: Bohrlegende | 3.2512 mm / 128.000 mil | 3.0500 mm / 120.079 mil | 2.5400 mm / 100.000 mil | 1.6256 mm / 64.000 mil | 1.5000 mm / 59.055 mil | 1.4000 mm / 55.118 mil | 1.0160 mm / 40.000 mil | 1.0000 mm / 39.370 mil | 0.9144 mm / 36.000 mil | 0.8000 mm / 31.496 mil | 0.7000 mm / 27.559 mil | 0.4000 mm / 15.748 mil | 0.2000 mm / 7.874 mil | DPL